# EAGLE design blimpy-2.1 (EAGLE 9.6.1)
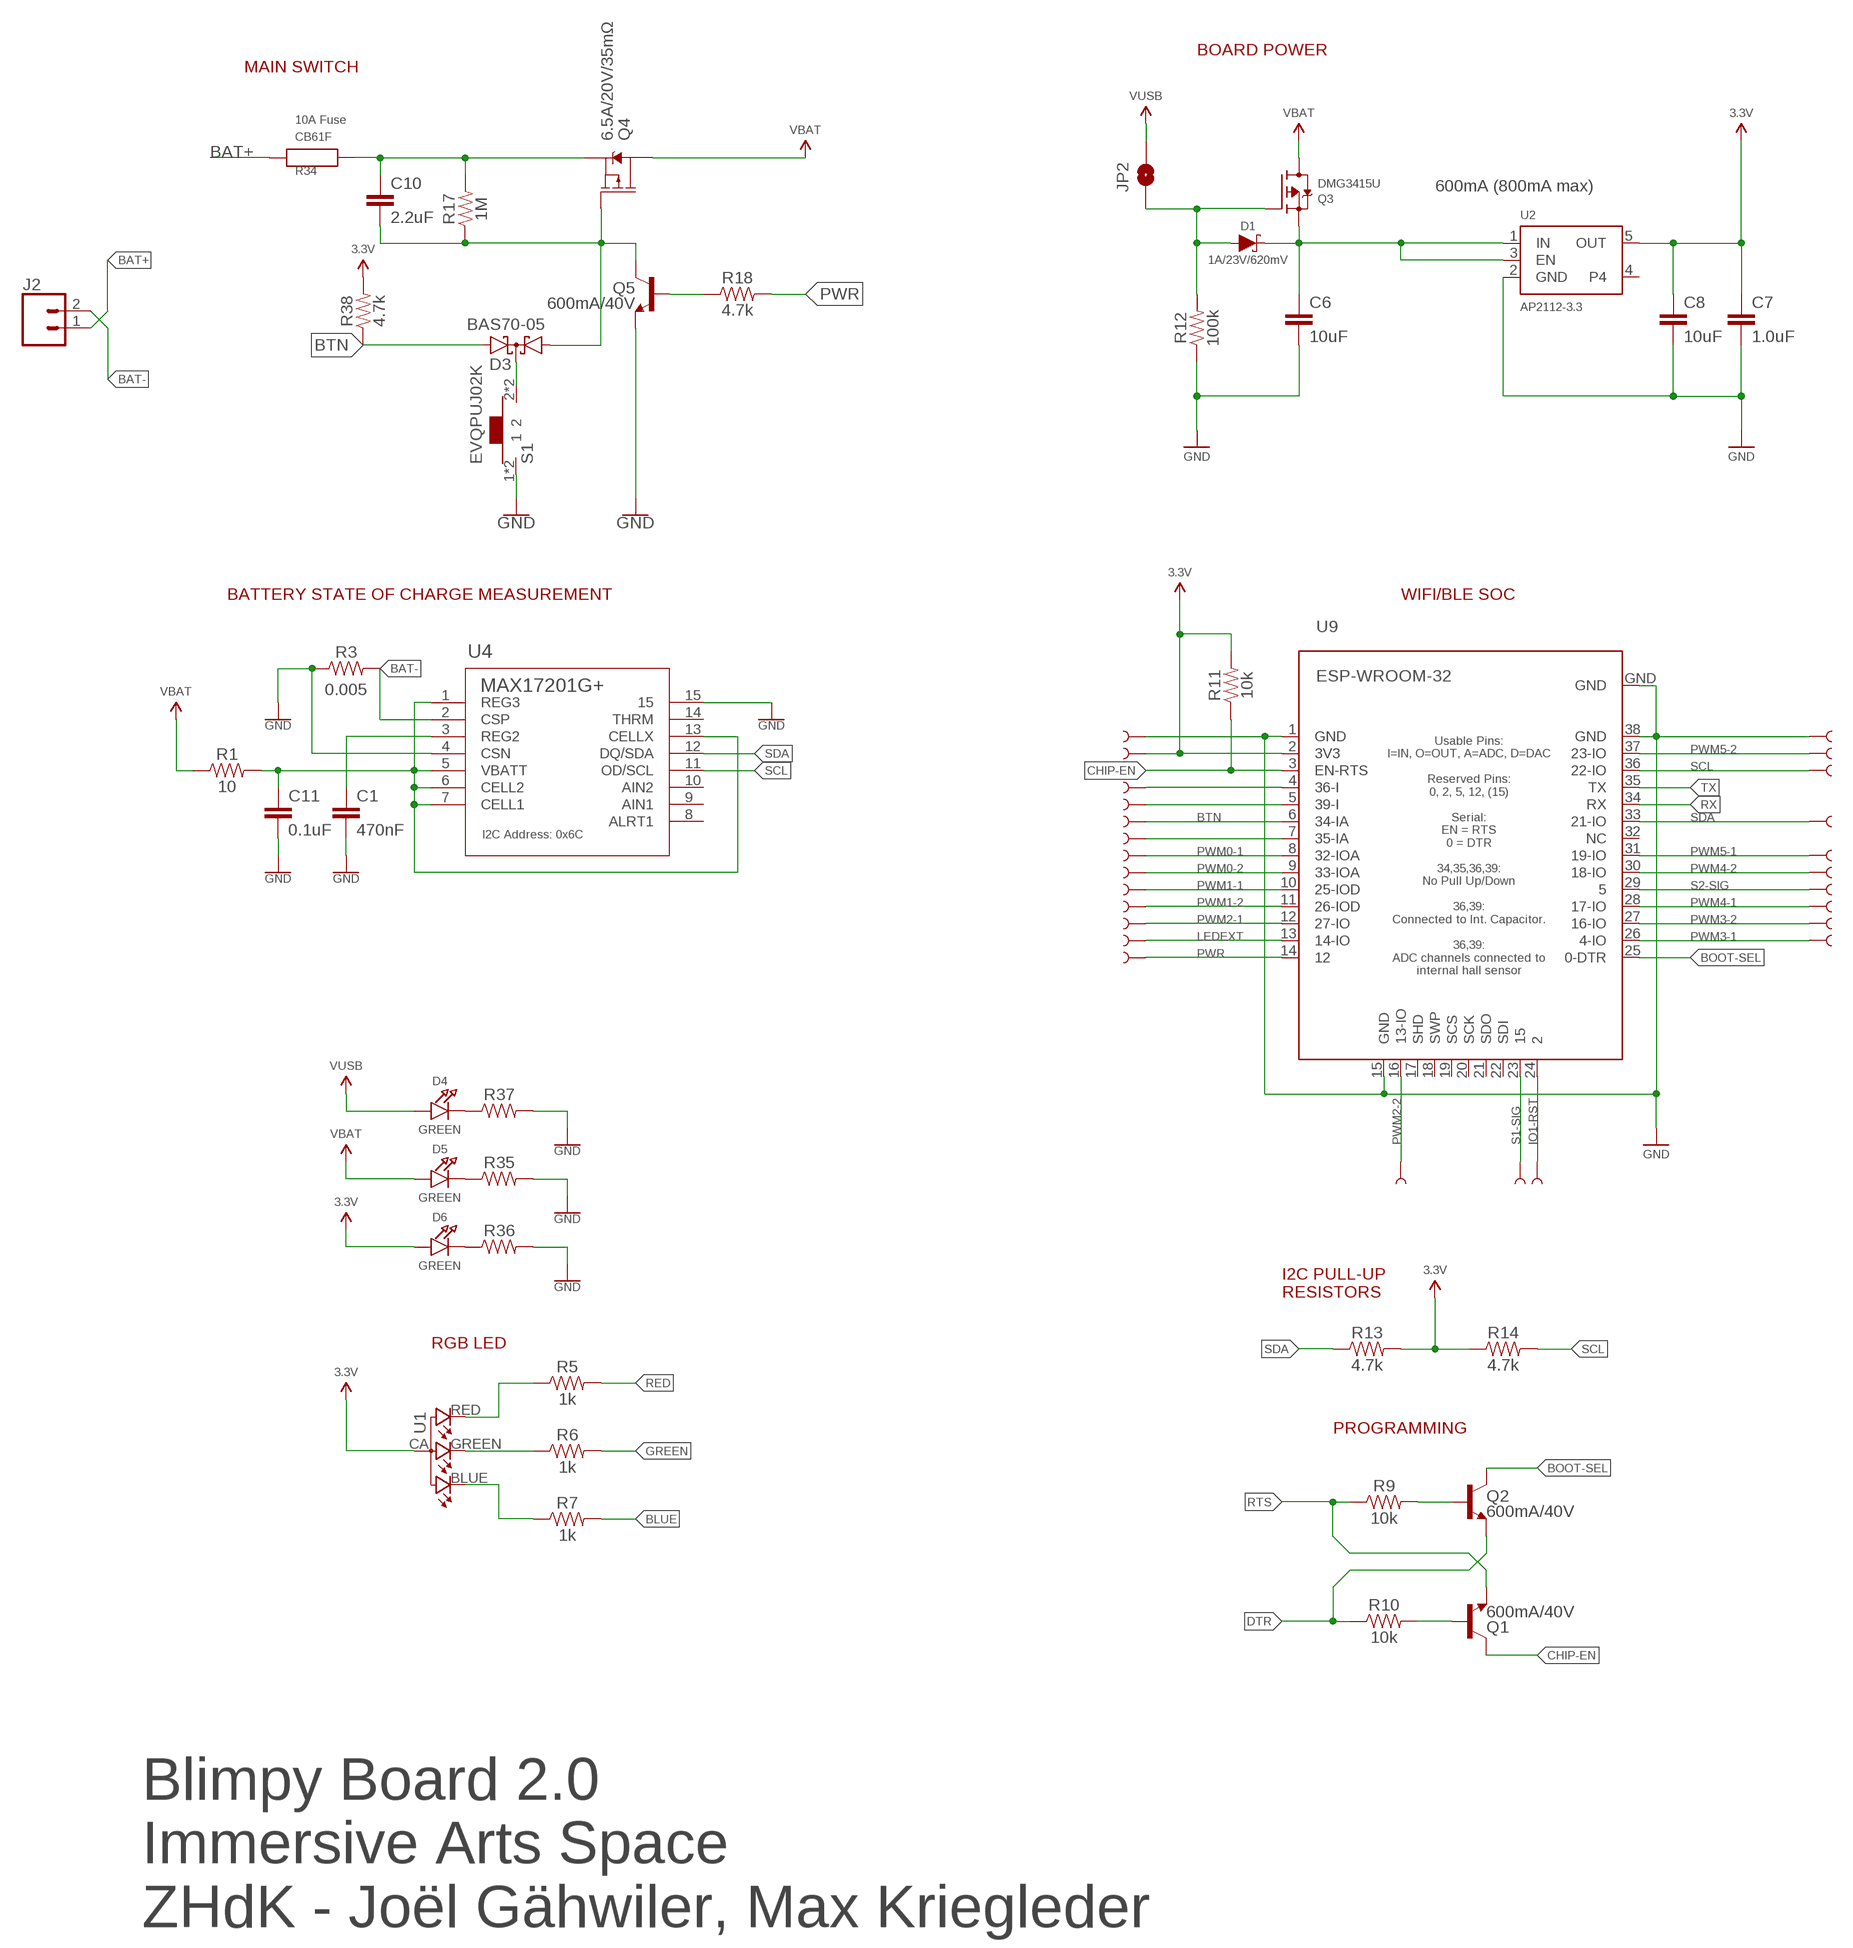
[diagram p0: schematic, sheet 1, part 1 of 2]
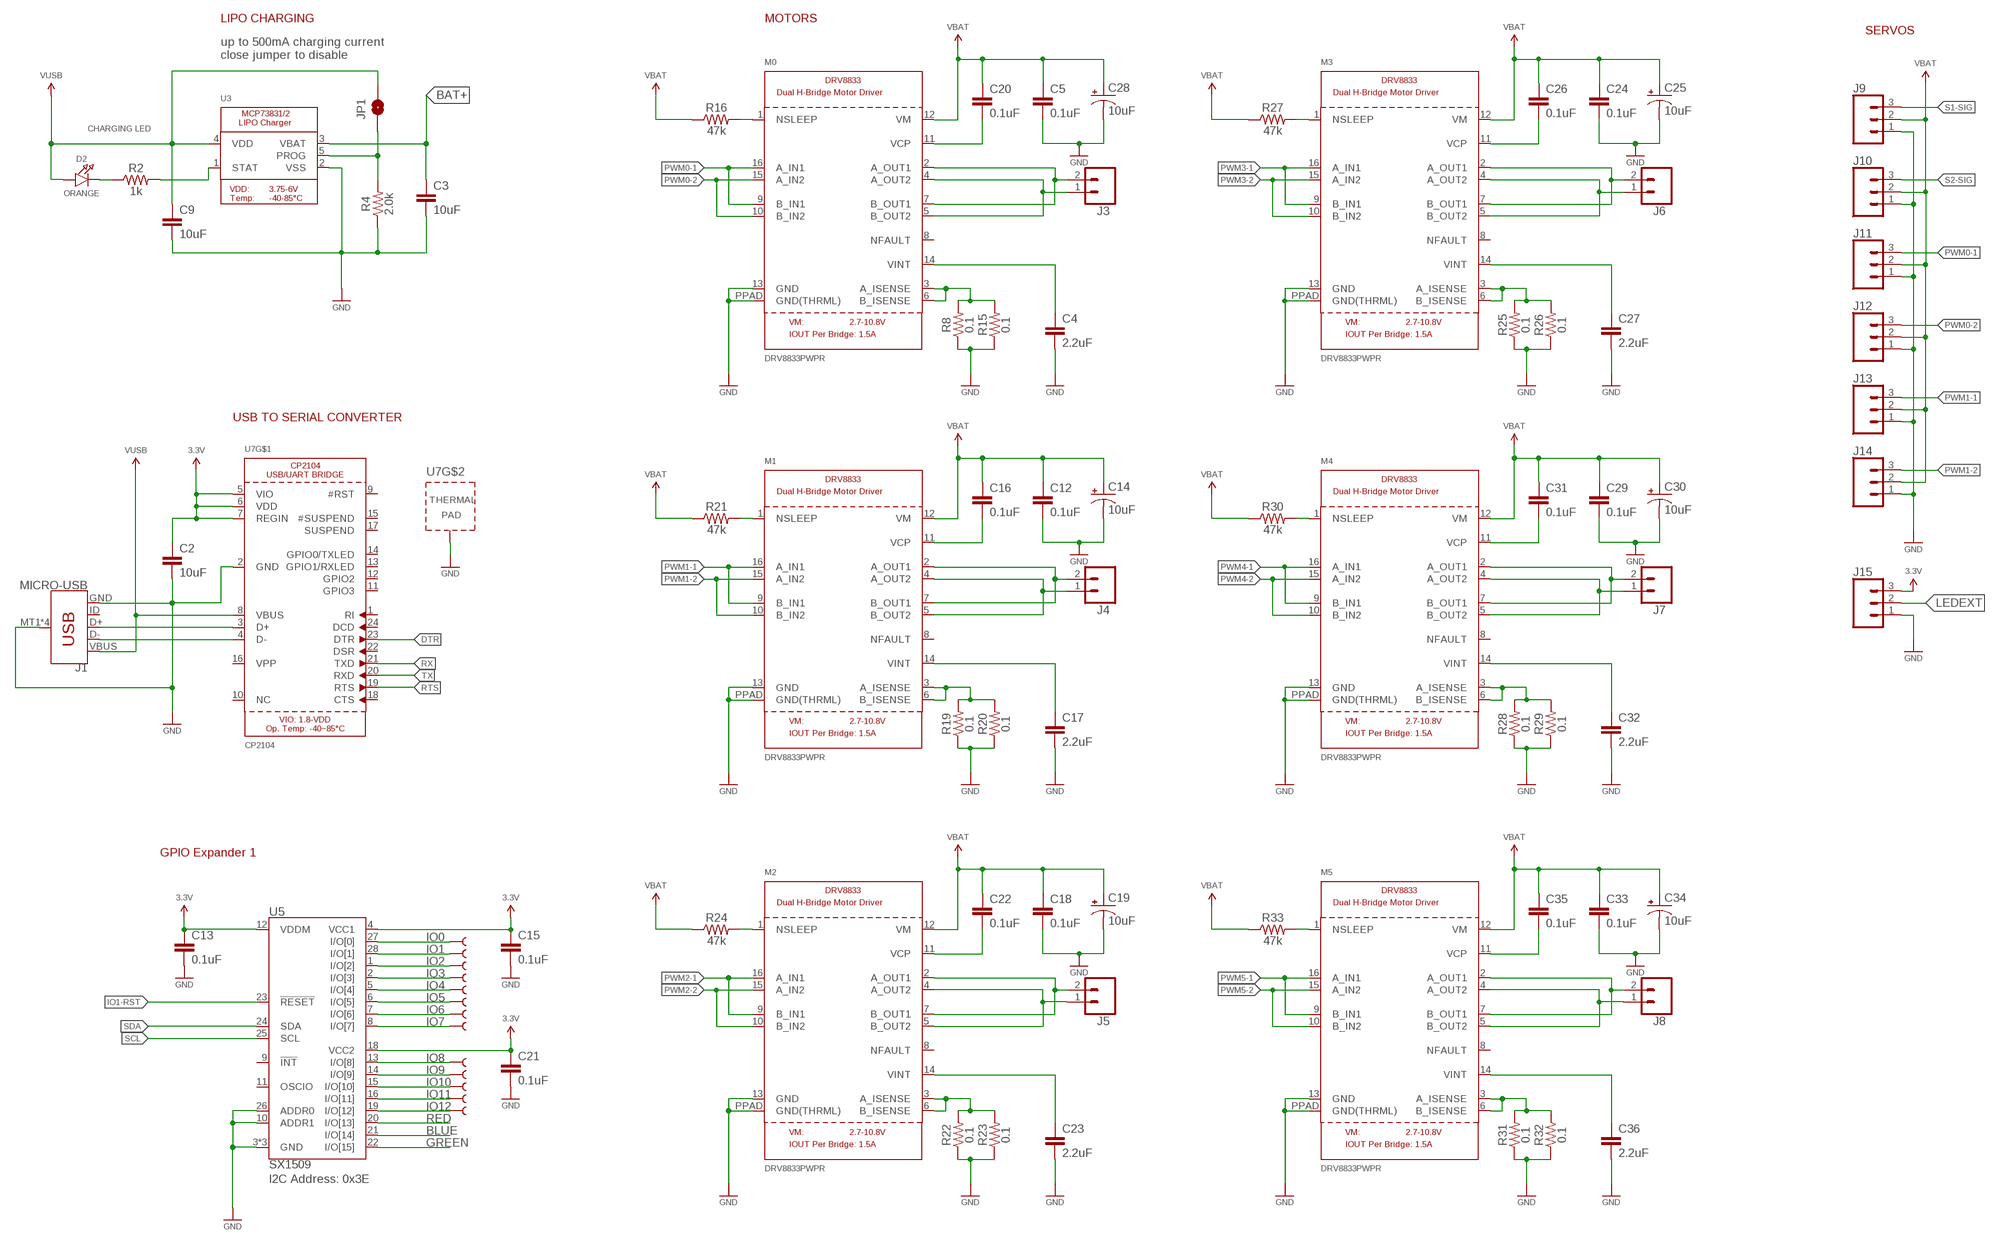
[diagram p1: schematic, sheet 1, part 2 of 2]

## Parts
C1  470nF  470NF-0608  [0603]
C2  10uF  10UF-0603-6.3V-20%  [0603]
C3  10uF  10UF-0603-6.3V-20%  [0603]
C4  2.2uF  2.2UF-0603-10V-20%  [0603]
C5  0.1uF  0.1UF-0603-25V-5%  [0603]
C6  10uF  10UF-0603-6.3V-20%  [0603]
C7  1.0uF  1.0UF-0603-16V-10%  [0603]
C8  10uF  10UF-0603-6.3V-20%  [0603]
C9  10uF  10UF-0603-6.3V-20%  [0603]
C10  2.2uF  2.2UF-0603-10V-20%  [0603]
C11  0.1uF  0.1UF-0603-25V-5%  [0603]
C12  0.1uF  0.1UF-0603-25V-5%  [0603]
C13  0.1uF  0.1UF-0603-25V-5%  [0603]
C14  10uF  10UF-POLAR-EIA3216-16V-10%(TANT)  [EIA3216]
C15  0.1uF  0.1UF-0603-25V-5%  [0603]
C16  0.1uF  0.1UF-0603-25V-5%  [0603]
C17  2.2uF  2.2UF-0603-10V-20%  [0603]
C18  0.1uF  0.1UF-0603-25V-5%  [0603]
C19  10uF  10UF-POLAR-EIA3216-16V-10%(TANT)  [EIA3216]
C20  0.1uF  0.1UF-0603-25V-5%  [0603]
C21  0.1uF  0.1UF-0603-25V-5%  [0603]
C22  0.1uF  0.1UF-0603-25V-5%  [0603]
C23  2.2uF  2.2UF-0603-10V-20%  [0603]
C24  0.1uF  0.1UF-0603-25V-5%  [0603]
C25  10uF  10UF-POLAR-EIA3216-16V-10%(TANT)  [EIA3216]
C26  0.1uF  0.1UF-0603-25V-5%  [0603]
C27  2.2uF  2.2UF-0603-10V-20%  [0603]
C28  10uF  10UF-POLAR-EIA3216-16V-10%(TANT)  [EIA3216]
C29  0.1uF  0.1UF-0603-25V-5%  [0603]
C30  10uF  10UF-POLAR-EIA3216-16V-10%(TANT)  [EIA3216]
C31  0.1uF  0.1UF-0603-25V-5%  [0603]
C32  2.2uF  2.2UF-0603-10V-20%  [0603]
C33  0.1uF  0.1UF-0603-25V-5%  [0603]
C34  10uF  10UF-POLAR-EIA3216-16V-10%(TANT)  [EIA3216]
C35  0.1uF  0.1UF-0603-25V-5%  [0603]
C36  2.2uF  2.2UF-0603-10V-20%  [0603]
D1  1A/23V/620mV  DIODE-SCHOTTKY-BAT20J  [SOD-323]
D2  ORANGE  LED0805_NOOUTLINE  [CHIPLED_0805_NOOUTLINE]
D3  BAS70-05  [SOT23]
D4  GREEN  LED0805_NOOUTLINE  [CHIPLED_0805_NOOUTLINE]
D5  GREEN  LED0805_NOOUTLINE  [CHIPLED_0805_NOOUTLINE]
D6  GREEN  LED0805_NOOUTLINE  [CHIPLED_0805_NOOUTLINE]
J1  MICRO-USB  USB_MICRO-B_SMT  [USB-MICROB]
J2  CONN_02PTH4  [1X02_XTRA_BIG]
J3  CONN_02-JST-2MM-SMT  [JST-2-SMD]
J4  CONN_02-JST-2MM-SMT  [JST-2-SMD]
J5  CONN_02-JST-2MM-SMT  [JST-2-SMD]
J6  CONN_02-JST-2MM-SMT  [JST-2-SMD]
J7  CONN_02-JST-2MM-SMT  [JST-2-SMD]
J8  CONN_02-JST-2MM-SMT  [JST-2-SMD]
J9  3-PIN SMD  CONN_03JST-SMD  [JST-3-SMD]
J10  3-PIN SMD  CONN_03JST-SMD  [JST-3-SMD]
J11  3-PIN SMD  CONN_03JST-SMD  [JST-3-SMD]
J12  3-PIN SMD  CONN_03JST-SMD  [JST-3-SMD]
J13  3-PIN SMD  CONN_03JST-SMD  [JST-3-SMD]
J14  3-PIN SMD  CONN_03JST-SMD  [JST-3-SMD]
J15  3-PIN SMD  CONN_03JST-SMD  [JST-3-SMD]
JP1  JUMPER-SMT_2_NO_SILK  [SMT-JUMPER_2_NO_SILK]
JP2  JUMPER-SMT_2_NO_SILK  [SMT-JUMPER_2_NO_SILK]
M0  DRV8833PWPR  DRV8833  [HTSSOP16]
M1  DRV8833PWPR  DRV8833  [HTSSOP16]
M2  DRV8833PWPR  DRV8833  [HTSSOP16]
M3  DRV8833PWPR  DRV8833  [HTSSOP16]
M4  DRV8833PWPR  DRV8833  [HTSSOP16]
M5  DRV8833PWPR  DRV8833  [HTSSOP16]
Q1  600mA/40V  TRANS_NPN-MMBT2222AL  [SOT23-3]
Q2  600mA/40V  TRANS_NPN-MMBT2222AL  [SOT23-3]
Q3  DMG3415U  MOSFET-P  [SOT23-R]
Q4  6.5A/20V/35mΩ  MOSFET_PCH-NDS8434  [SO08]
Q5  600mA/40V  TRANS_NPN-MMBT2222AL  [SOT23-3]
R1  10  10OHM-0603-1/10W-1%  [0603]
R2  1k  1KOHM-0603-1/10W-1%  [0603]
R3  0.005  RESISTOR1206  [1206]
R4  2.0k  2.0KOHM-0603-1/10W-5%  [0603]
R5  1k  1KOHM-0603-1/10W-1%  [0603]
R6  1k  1KOHM-0603-1/10W-1%  [0603]
R7  1k  1KOHM-0603-1/10W-1%  [0603]
R8  0.1  RESISTOR1206  [1206]
R9  10k  10KOHM-0603-1/10W-1%  [0603]
R10  10k  10KOHM-0603-1/10W-1%  [0603]
R11  10k  10KOHM-0603-1/10W-1%  [0603]
R12  100k  100KOHM-0603-1/10W-1%  [0603]
R13  4.7k  4.7KOHM-0603-1/10W-1%  [0603]
R14  4.7k  4.7KOHM-0603-1/10W-1%  [0603]
R15  0.1  RESISTOR1206  [1206]
R16  47k  47KOHM-0603-1/10W-1%  [0603]
R17  1M  1MOHM-0603-1/4W-5%  [0603]
R18  4.7k  4.7KOHM-0603-1/10W-1%  [0603]
R19  0.1  RESISTOR1206  [1206]
R20  0.1  RESISTOR1206  [1206]
R21  47k  47KOHM-0603-1/10W-1%  [0603]
R22  0.1  RESISTOR1206  [1206]
R23  0.1  RESISTOR1206  [1206]
R24  47k  47KOHM-0603-1/10W-1%  [0603]
R25  0.1  RESISTOR1206  [1206]
R26  0.1  RESISTOR1206  [1206]
R27  47k  47KOHM-0603-1/10W-1%  [0603]
R28  0.1  RESISTOR1206  [1206]
R29  0.1  RESISTOR1206  [1206]
R30  47k  47KOHM-0603-1/10W-1%  [0603]
R31  0.1  RESISTOR1206  [1206]
R32  0.1  RESISTOR1206  [1206]
R33  47k  47KOHM-0603-1/10W-1%  [0603]
R34  CB61F  [CB61F]
R35  RESISTOR0603  [0603]
R36  RESISTOR0603  [0603]
R37  RESISTOR0603  [0603]
R38  4.7k  1MOHM-0603-1/4W-5%  [0603]
S1  EVQPUJ02K  [EVQPUJ02K]
TP1  TEST-POINT3  [PAD.03X.03]
TP2  TEST-POINT3  [PAD.03X.03]
TP3  TEST-POINT3  [PAD.03X.03]
TP4  TEST-POINT3  [PAD.03X.03]
TP5  TEST-POINT3  [PAD.03X.03]
TP6  TEST-POINT3  [PAD.03X.03]
TP7  TEST-POINT3  [PAD.03X.03]
TP8  TEST-POINT3  [PAD.03X.03]
TP9  TEST-POINT3  [PAD.03X.03]
TP10  TEST-POINT3  [PAD.03X.03]
TP11  TEST-POINT3  [PAD.03X.03]
TP12  TEST-POINT3  [PAD.03X.03]
TP13  TEST-POINT3  [PAD.03X.03]
TP14  TEST-POINT3  [PAD.03X.03]
TP15  TEST-POINT3  [PAD.03X.03]
TP16  TEST-POINT3  [PAD.03X.03]
TP17  TEST-POINT3  [PAD.03X.03]
TP18  TEST-POINT3  [PAD.03X.03]
TP19  TEST-POINT3  [PAD.03X.03]
TP20  TEST-POINT3  [PAD.03X.03]
TP21  TEST-POINT3  [PAD.03X.03]
TP22  TEST-POINT3  [PAD.03X.03]
TP23  TEST-POINT3  [PAD.03X.03]
TP24  TEST-POINT3  [PAD.03X.03]
TP25  TEST-POINT3  [PAD.03X.03]
TP26  TEST-POINT3  [PAD.03X.03]
TP27  TEST-POINT3  [PAD.03X.03]
TP28  TEST-POINT3  [PAD.03X.03]
TP29  TEST-POINT3  [PAD.03X.03]
TP30  TEST-POINT3  [PAD.03X.03]
TP31  TEST-POINT3  [PAD.03X.03]
TP32  TEST-POINT3  [PAD.03X.03]
TP33  TEST-POINT3  [PAD.03X.03]
TP34  TEST-POINT3  [PAD.03X.03]
TP35  TEST-POINT3  [PAD.03X.03]
TP36  TEST-POINT3  [PAD.03X.03]
TP37  TEST-POINT3  [PAD.03X.03]
TP38  TEST-POINT3  [PAD.03X.03]
TP39  TEST-POINT3  [PAD.03X.03]
U1  PARTICLE_RGB-LED-CLMVB-FKARGB  [PARTICLE_PLCC4-2MM-RGB]
U2  AP2112-3.3  VREG_SOT23-5  [SOT23-5]
U3  MICROBUILDER_MCP73831/2  [MICROBUILDER_SOT23-5]
U4  MAX17201G+  [21-0137I_T1433-1_MXM]
U5  SX1509  [QFN-28]
U7  CP2104  [QFN24_4MM_SMSC]
U9  ESP-WROOM-32  [ESP-WROOM-32]

## Nets
3.3V: C2.1 C7.1 C8.1 C13.1 C15.1 C21.1 D6.A J15.3 R11.2 R13.2 R14.1 R38.2 TP11.P$1 U1.CA U2.5(OUT) U5.4(VCC1) U5.12(VDDM) U5.18(VCC2) U7.5(VIO) U7.6(VDD) U7.7(REGIN) U9.2(3V3)
BAT+: C3.1 J2.1 R34.1 U3.3(VBAT)
BAT-: J2.2 R3.2 U4.2(CSP)
BLUE: R7.2 U5.21(I/O[14])
BOOT-SEL: Q2.3(C) U9.25(0-DTR)
BTN: D3.2(A2) R38.1 TP8.P$1 U9.6(34-IA)
CHIP-EN: Q1.3(C) R11.1 U9.3(EN-RTS)
DTR: Q2.2(E) R10.1 U7.23(DTR)
GND: C1.2 C2.2 C3.2 C4.2 C5.2 C6.2 C7.2 C8.2 C9.2 C11.2 C12.2 C13.2 C14.- C15.2 C17.2 C18.2 C19.- C21.2 C23.2 C24.2 C25.- C27.2 C28.- C29.2 C30.- C32.2 C33.2 C34.- C36.2 J1.GND J1.MT1(SHIELD) J1.MT2(SHIELD) J1.P$1(SHIELD) J1.P$2(SHIELD) J9.1 J10.1 J11.1 J12.1 J13.1 J14.1 J15.1 M0.13(GND) M0.PPAD(GND(THRML)) M1.13(GND) M1.PPAD(GND(THRML)) M2.13(GND) M2.PPAD(GND(THRML)) M3.13(GND) M3.PPAD(GND(THRML)) M4.13(GND) M4.PPAD(GND(THRML)) M5.13(GND) M5.PPAD(GND(THRML)) Q5.2(E) R3.1 R4.1 R8.1 R12.1 R15.1 R19.1 R20.1 R22.1 R23.1 R25.1 R26.1 R28.1 R29.1 R31.1 R32.1 R35.2 R36.2 R37.2 S1.1 S1.3 TP12.P$1 TP13.P$1 U2.2(GND) U3.2(VSS) U4.4(CSN) U4.15 U5.3(GND) U5.10(ADDR1) U5.17(GND) U5.26(ADDR0) U5.29(GND) U7.2(GND) U7.THERM(TP) U9.1(GND) U9.15(GND) U9.38(GND) U9.GND
GREEN: R6.2 U5.22(I/O[15])
IO0: TP27.P$1 U5.27(I/O[0])
IO1: TP28.P$1 U5.28(I/O[1])
IO1-RST: TP26.P$1 U5.23(!RESET) U9.24
IO2: TP29.P$1 U5.1(I/O[2])
IO3: TP30.P$1 U5.2(I/O[3])
IO4: TP31.P$1 U5.5(I/O[4])
IO5: TP32.P$1 U5.6(I/O[5])
IO6: TP33.P$1 U5.7(I/O[6])
IO7: TP34.P$1 U5.8(I/O[7])
IO8: TP35.P$1 U5.13(I/O[8])
IO9: TP36.P$1 U5.14(I/O[9])
IO10: TP37.P$1 U5.15(I/O[10])
IO11: TP38.P$1 U5.16(I/O[11])
IO12: TP39.P$1 U5.19(I/O[12])
LEDEXT: J15.2 TP5.P$1 U9.13(14-IO)
N$1: D2.C R2.1
N$2: J1.D+ U7.3(D+)
N$3: R2.2 U3.1(STAT)
N$4: JP1.1 R4.2 U3.5(PROG)
N$5: M0.1(NSLEEP) R16.2
N$6: J1.D- U7.4(D-)
N$7: C6.1 D1.C Q3.2(S) U2.1(IN) U2.3(EN)
N$8: C1.1 U4.3(REG2)
N$9: R5.1 U1.RED
N$10: R7.1 U1.BLUE
N$11: R6.1 U1.GREEN
N$12: Q1.1(B) R10.2
N$13: Q2.1(B) R9.2
N$14: M0.3(A_ISENSE) M0.6(B_ISENSE) R8.2 R15.2
N$15: C11.1 R1.2 U4.1(REG3) U4.5(VBATT) U4.6(CELL2) U4.7(CELL1) U4.13(CELLX)
N$16: C10.2 D3.1(A1) Q4.4(G) Q5.3(C) R17.1
N$17: D4.C R37.1
N$18: C10.1 Q4.1(S) Q4.2(S) Q4.3(S) R17.2 R34.2
N$19: TP9.P$1 U9.5(39-I)
N$20: D1.A JP2.1 Q3.1(G) R12.2
N$21: TP7.P$1 U9.7(35-IA)
N$22: D3.3(C) S1.2 S1.4
N$23: Q5.1(B) R18.1
N$24: J4.1 M1.4(A_OUT2) M1.5(B_OUT2)
N$25: J4.2 M1.2(A_OUT1) M1.7(B_OUT1)
N$26: C17.1 M1.14(VINT)
N$27: C16.2 M1.11(VCP)
N$28: M1.3(A_ISENSE) M1.6(B_ISENSE) R19.2 R20.2
N$29: M1.1(NSLEEP) R21.2
N$30: J6.1 M3.4(A_OUT2) M3.5(B_OUT2)
N$31: J5.1 M2.4(A_OUT2) M2.5(B_OUT2)
N$32: C23.1 M2.14(VINT)
N$33: C22.2 M2.11(VCP)
N$34: M2.3(A_ISENSE) M2.6(B_ISENSE) R22.2 R23.2
N$35: M2.1(NSLEEP) R24.2
N$36: J6.2 M3.2(A_OUT1) M3.7(B_OUT1)
N$37: J3.2 M0.2(A_OUT1) M0.7(B_OUT1)
N$38: J7.1 M4.4(A_OUT2) M4.5(B_OUT2)
N$39: C27.1 M3.14(VINT)
N$40: C26.2 M3.11(VCP)
N$41: M3.3(A_ISENSE) M3.6(B_ISENSE) R25.2 R26.2
N$42: M3.1(NSLEEP) R27.2
N$43: J8.2 M5.2(A_OUT1) M5.7(B_OUT1)
N$44: J7.2 M4.2(A_OUT1) M4.7(B_OUT1)
N$45: C32.1 M4.14(VINT)
N$46: C31.2 M4.11(VCP)
N$47: M4.3(A_ISENSE) M4.6(B_ISENSE) R28.2 R29.2
N$48: J5.2 M2.2(A_OUT1) M2.7(B_OUT1)
N$49: M4.1(NSLEEP) R30.2
N$50: J8.1 M5.4(A_OUT2) M5.5(B_OUT2)
N$51: D6.C R36.1
N$52: C36.1 M5.14(VINT)
N$53: C35.2 M5.11(VCP)
N$54: M5.3(A_ISENSE) M5.6(B_ISENSE) R31.2 R32.2
N$55: M5.1(NSLEEP) R33.2
N$56: D5.C R35.1
N$57: TP10.P$1 U9.4(36-I)
N$58: J3.1 M0.4(A_OUT2) M0.5(B_OUT2)
N$61: C4.1 M0.14(VINT)
N$64: C20.2 M0.11(VCP)
PWM0-1: J11.3 M0.9(B_IN1) M0.16(A_IN1) TP1.P$1 U9.8(32-IOA)
PWM0-2: J12.3 M0.10(B_IN2) M0.15(A_IN2) TP2.P$1 U9.9(33-IOA)
PWM1-1: J13.3 M1.9(B_IN1) M1.16(A_IN1) TP3.P$1 U9.10(25-IOD)
PWM1-2: J14.3 M1.10(B_IN2) M1.15(A_IN2) TP6.P$1 U9.11(26-IOD)
PWM2-1: M2.9(B_IN1) M2.16(A_IN1) TP17.P$1 U9.12(27-IO)
PWM2-2: M2.10(B_IN2) M2.15(A_IN2) TP23.P$1 U9.16(13-IO)
PWM3-1: M3.9(B_IN1) M3.16(A_IN1) TP16.P$1 U9.26(4-IO)
PWM3-2: M3.10(B_IN2) M3.15(A_IN2) TP15.P$1 U9.27(16-IO)
PWM4-1: M4.9(B_IN1) M4.16(A_IN1) TP22.P$1 U9.28(17-IO)
PWM4-2: M4.10(B_IN2) M4.15(A_IN2) TP21.P$1 U9.30(18-IO)
PWM5-1: M5.9(B_IN1) M5.16(A_IN1) TP20.P$1 U9.31(19-IO)
PWM5-2: M5.10(B_IN2) M5.15(A_IN2) TP14.P$1 U9.37(23-IO)
PWR: R18.2 TP4.P$1 U9.14
RED: R5.2 U5.20(I/O[13])
RTS: Q1.2(E) R9.1 U7.19(RTS)
RX: U7.21(TXD) U9.34(RX)
S1-SIG: J9.3 TP24.P$1 U9.23
S2-SIG: J10.3 TP25.P$1 U9.29
SCL: R14.2 TP18.P$1 U4.11(OD/SCL) U5.25(SCL) U9.36(22-IO)
SDA: R13.1 TP19.P$1 U4.12(DQ/SDA) U5.24(SDA) U9.33(21-IO)
TX: U7.20(RXD) U9.35(TX)
V_BATT: C5.1 C12.1 C14.+ C16.1 C18.1 C19.+ C20.1 C22.1 C24.1 C25.+ C26.1 C28.+ C29.1 C30.+ C31.1 C33.1 C34.+ C35.1 D5.A J9.2 J10.2 J11.2 J12.2 J13.2 J14.2 M0.12(VM) M1.12(VM) M2.12(VM) M3.12(VM) M4.12(VM) M5.12(VM) Q3.3(D) Q4.5(D) Q4.6(D) Q4.7(D) Q4.8(D) R1.1 R16.1 R21.1 R24.1 R27.1 R30.1 R33.1 ; supply symbol labelled VBAT
V_USB: C9.1 D2.A D4.A J1.VBUS JP1.2 JP2.2 U3.4(VDD) U7.8(VBUS) ; supply symbol labelled VUSB
Unconnected: J1.ID M0.8(NFAULT) M1.8(NFAULT) M2.8(NFAULT) M3.8(NFAULT) M4.8(NFAULT) M5.8(NFAULT) U2.4 U4.8(ALRT1) U4.9(AIN1) U4.10(AIN2) U4.14(THRM) U5.9(!INT) U5.11(OSCIO) U7.1(RI) U7.9(#RST) U7.10(NC) U7.11(GPIO3) U7.12(GPIO2) U7.13(GPIO1/RXLED) U7.14(GPIO0/TXLED) U7.15(#SUSPEND) U7.16(VPP) U7.17(SUSPEND) U7.18(CTS) U7.22(DSR) U7.24(DCD) U9.17(SHD) U9.18(SWP) U9.19(SCS) U9.20(SCK) U9.21(SDO) U9.22(SDI) U9.32(NC)

## Notes on the sheet
- LIPO CHARGING | MOTORS
- BOARD POWER | SERVOS
- MAIN SWITCH
- up to 500mA charging current
  close jumper to disable
- 10A Fuse
- 600mA (800mA max) | CHARGING LED
- BATTERY STATE OF CHARGE MEASUREMENT | WIFI/BLE SOC | USB TO SERIAL CONVERTER
- I2C Address: 0x6C
- GPIO Expander 1
- I2C PULL-UP
  RESISTORS
- RGB LED
- PROGRAMMING
- I2C Address: 0x3E
- Blimpy Board 2.0
  Immersive Arts Space
  ZHdK - Joël Gähwiler, Max Kriegleder

## Library data of the parts
C1 = SparkFun-Capacitors:470NF: 0.47uF/470nF ceramic capacitors A capacitor is a passive two-terminal electrical component used to store electrical energy temporarily in an electric field.
C2 C3 C6 C8 C9 = SparkFun-Capacitors:10UF: 10.0µF ceramic capacitors A capacitor is a passive two-terminal electrical component used to store electrical energy temporarily in an electric field.; PROD_ID: CAP-11015
C4 C10 C17 C23 C27 C32 C36 = SparkFun-Capacitors:2.2UF: 2.2µF ceramic capacitors A capacitor is a passive two-terminal electrical component used to store electrical energy temporarily in an electric field.; PROD_ID: CAP-07888
C5 C11-C13 C15 C16 C18 C20-C22 C24 C26 C29 C31 C33 C35 = SparkFun-Capacitors:0.1UF: 0.1µF ceramic capacitors A capacitor is a passive two-terminal electrical component used to store electrical energy temporarily in an electric field.; PROD_ID: CAP-08604
C7 = SparkFun-Capacitors:1.0UF: 1µF ceramic capacitors A capacitor is a passive two-terminal electrical component used to store electrical energy temporarily in an electric field.; PROD_ID: CAP-00868
C14 C19 C25 C28 C30 C34 = SparkFun-Capacitors:10UF-POLAR: 10.0µF polarized capacitors A capacitor is a passive two-terminal electrical component used to store electrical energy temporarily in an electric field.; PROD_ID: CAP-00811
D1 = SparkFun-DiscreteSemi:DIODE-SCHOTTKY: Schottky diode A Schottky diode is a semiconductor diode which has a low forward voltage drop and a very fast switching action.; PROD_ID: DIO-11623
D2 D4-D6 = microbuilder:LED: LED 0603 - 0603 Surface Mount Package 2mA: Green LED - Low Power (3.9mcd, 2ma, 1.7Vf) - Digikey: 475-2709-2-ND Orange LED - Low Power (9.8mcd, 2ma, 1.8Vf) - Digikey: 475-1194-2-ND Red LED - Low Power (5mcd, 2ma, 1.8Vf) - Digikey: 475-1195-2-ND Yellow LED - Low Power (7mcd, 2ma, 1.8Vf) - Digikey: 475-1196-2-ND 5mA: Blue LED - Low Power (17mcd, 5ma, 2.9Vf) - Digikey: LNJ937W8CRACT-ND 0805 - 0805 Surface Mount Package 2mA: Red LED (8.8mcd, 2mA, 1.8Vf, Clear) - Low Power [Digikey: 475-2510-1-ND] Green LED (5mcd, 2mA, 1.8Vf, Clear) - Low Power [Digikey: 475-2730-1-ND] Yellow LED (11.3mcd, 2mA, 1.8Vf, Clear) - Low Power [Digikey: 475-2555-1-ND] 20mA: Red LED (104mcd, 20mA, Diffused) - LS R976 [Digikey: 475-1278-6-ND] Red LED (12mcd, 20mA, 2.0Vf, Clear) - APT2012EC [Digikey: 754-1128-1-ND] Green LED (15mcd, 20mA, 2.2Vf, Clear) - APT2012GC [Digikey: 754-1131-1-ND] Orange LED (160mcd, 20mA, 2.1Vf, Clear) - APT2012SECK [Digikey: 754-1130-1-ND] 1206 - 1206 Surface Mount Package Green LED (26mcd, 20mA, Diffused) - LG N971 [Digikey: 475-1407-6-ND] Red LED (15mcd, 20mA, Diffused) - LH N974 [Digikey: 475-1416-6-ND] Cree - Cree High-Power Surface Mount LEDs XPEBWT-L1-0000-00D50 - White 111lm 350mA 2.9Vf 6200K 110° XTEAWT-00-0000-00000LEE3 - White 114lm 350mA 2.85Vf 5000K 115° Everlight - Everlight 45-21 Series Surface Mount LEDs 45-21/QK2C-B2832AC2CB2/2T - Warm White 2000mcd 20mA 3.25Vf 3050K 120° 45-21/LK2C-B38452C4CB2/2T - Nuetral White 2000mcd 20mA 3.25Vf 4150K 120° 45-21/LK2C-B50634C6CB2/2T - Cold White 2200mcd 20mA 3.25Vf 5650K 120° PLCC2 Reverse Mount LS T77K-J1L2-1-0-2-R18-Z - Red 11.25mcd 2mA 1.8Vf 630nm 120° LO T77K-L1M2-24-Z - Orange 19.6mcd 2mA 1.8Vf 606nm 120° LY T77K-K2M1-26-Z - Yellow 15.7mcd 2mA 1.8Vf 587nm 120°
D3 = diode:BAS70-05: Silicon Schottky Diodes General-purpose diode for high-speed switching
J1 = SparkFun-Connectors:USB_MICRO-B: USB Type Micro-B Connector Male/female and PTH/SMT variants SparkFun Products: SparkFun microB USB Breakout <https://www.sparkfun.com/products/12035> SparkFun USB microB Plug Breakout <https://www.sparkfun.com/products/10031> SparkFun ESP8266 Thing <https://www.sparkfun.com/products/13231>; PROD_ID: CONN-09505; SF_ID: PRT-08533
J2 = SparkFun-Connectors:CONN_02: Multi connection point. Often used as Generic Header-pin footprint for 0.1 inch spaced/style header connections On any of the 0.1 inch spaced packages, you can populate with these: Break Away Headers - Straight <https://www.sparkfun.com/products/116> (PRT-00116) Break Away Male Headers - Right Angle <https://www.sparkfun.com/products/553> (PRT-00553) Female Headers <https://www.sparkfun.com/products/115> (PRT-00115) Break Away Headers - Machine Pin <https://www.sparkfun.com/products/117> (PRT-00117) Break Away Female Headers - Swiss Machine Pin <https://www.sparkfun.com/products/743> (PRT-00743) For SCREWTERMINALS and SPRING TERMINALS visit here: Screw Terimnals on SparkFun.com <https://www.sparkfun.com/search/results?term=Screw+Terminals> (5mm/3.5mm/2.54mm spacing) This device is also useful as a general connection point to wire up your design to another part of your project. Our various solder wires solder well into these plated through hole pads. Hook-Up Wire - Assortment (Stranded, 22 AWG) <https://www.sparkfun.com/products/11375> (PRT-11375) Hook-Up Wire - Assortment (Solid Core, 22 AWG) <https://www.sparkfun.com/products/11367> (PRT-11367) View the entire wire category on our website here <https://www.sparkfun.com/categories/141> Special notes: Molex polarized connector foot print use with: PRT-08233 with associated crimp pins and housings. 2.54_SCREWTERM for use with PRT-10571. 3.5mm Screw Terminal footprints for PRT-08084 5mm Screw Terminal footprints for use with PRT-08432
J3-J8 = SparkFun-Connectors:CONN_02: Multi connection point. Often used as Generic Header-pin footprint for 0.1 inch spaced/style header connections On any of the 0.1 inch spaced packages, you can populate with these: Break Away Headers - Straight <https://www.sparkfun.com/products/116> (PRT-00116) Break Away Male Headers - Right Angle <https://www.sparkfun.com/products/553> (PRT-00553) Female Headers <https://www.sparkfun.com/products/115> (PRT-00115) Break Away Headers - Machine Pin <https://www.sparkfun.com/products/117> (PRT-00117) Break Away Female Headers - Swiss Machine Pin <https://www.sparkfun.com/products/743> (PRT-00743) For SCREWTERMINALS and SPRING TERMINALS visit here: Screw Terimnals on SparkFun.com <https://www.sparkfun.com/search/results?term=Screw+Terminals> (5mm/3.5mm/2.54mm spacing) This device is also useful as a general connection point to wire up your design to another part of your project. Our various solder wires solder well into these plated through hole pads. Hook-Up Wire - Assortment (Stranded, 22 AWG) <https://www.sparkfun.com/products/11375> (PRT-11375) Hook-Up Wire - Assortment (Solid Core, 22 AWG) <https://www.sparkfun.com/products/11367> (PRT-11367) View the entire wire category on our website here <https://www.sparkfun.com/categories/141> Special notes: Molex polarized connector foot print use with: PRT-08233 with associated crimp pins and housings. 2.54_SCREWTERM for use with PRT-10571. 3.5mm Screw Terminal footprints for PRT-08084 5mm Screw Terminal footprints for use with PRT-08432; PROD_ID: CONN-11443
J9-J15 = SparkFun-Connectors:CONN_03: Multi connection point. Often used as Generic Header-pin footprint for 0.1 inch spaced/style header connections On any of the 0.1 inch spaced packages, you can populate with these: Break Away Headers - Straight <https://www.sparkfun.com/products/116> (PRT-00116) Break Away Male Headers - Right Angle <https://www.sparkfun.com/products/553> (PRT-00553) Female Headers <https://www.sparkfun.com/products/115> (PRT-00115) Break Away Headers - Machine Pin <https://www.sparkfun.com/products/117> (PRT-00117) Break Away Female Headers - Swiss Machine Pin <https://www.sparkfun.com/products/743> (PRT-00743) Stackable Header - 3 Pin (Female, 0.1") <https://www.sparkfun.com/products/13875> (PRT-13875) For SCREWTERMINALS and SPRING TERMINALS visit here: Screw Terimnals on SparkFun.com <https://www.sparkfun.com/search/results?term=Screw+Terminals> (5mm/3.5mm/2.54mm spacing) This device is also useful as a general connection point to wire up your design to another part of your project. Our various solder wires solder well into these plated through hole pads. Hook-Up Wire - Assortment (Stranded, 22 AWG) <https://www.sparkfun.com/products/11375> (PRT-11375) Hook-Up Wire - Assortment (Solid Core, 22 AWG) <https://www.sparkfun.com/products/11367> (PRT-11367) View the entire wire category on our website here <https://www.sparkfun.com/categories/141> Special notes: Molex polarized connector foot print use with SKU : PRT-08232 with associated crimp pins and housings.; PROD_ID: CONN-12591
JP1 JP2 = SparkFun-Jumpers:JUMPER-SMT_2_NO: Normally open jumper This jumper has two pads in close proximity to each other. Apply solder to close the connection. Round pads are easier to solder for beginners, but are a lot larger. SparkFun Product that uses the round pads: SparkFun EL Sequencer <https://www.sparkfun.com/products/12781>
M0 M1-M5 = microbuilder:DRV8833: DRV8833 Dual H-Bridge Motor Driver -- HTSSOP Package
Q1 Q2 Q5 = SparkFun-DiscreteSemi:TRANS_NPN: NPN transistor Current controlled devices typically used to amplify current or used as a switch. BC547 - COM-08928 <http://www.sparkfun.com/products/8928> (TO-92 45V 100mA) (1.Collector 2.Base 3.Emitter) 2N3904 - COM-00521 <http://www.sparkfun.com/products/521> (TO-92 40V 200mA) (1.Emitter 2.Base 3.Collector) P2N2222A - COM-12852 <http://www.sparkfun.com/products/12852> (TO-92 40V 600mA) (1.Collector 2.Base 3.Emitter); PROD_ID: TRANS-08049
Q3 = microbuilder:MOSFET-P: P-Channel Mosfet LEGEND VDS: Voltage Drain-Source ID: Drain Current RDS(ON): Drain-Source On-State Resistance VGS(TH): Gate-Source Threshold Voltage CISS: Drain-Source Input Capacitance SOT-23 Name VDS ID RDS(ON) VGS(TH) CISS Order Number IRLML5103 30V 760mA 600 mOhm -- 75pF @ 25V Digikey: IRLML5103PBFCT-ND IRLML6401 12V 4.3A 50 mOhm 950mV @ 250µA 830pF @ 10V Digikey: IRLML6401PBFTR-ND NTR0202PL 20V 400mA 800 mOhm 2.3V @ 250uA 70pF @ 5V Digikey: NTR0202PLT1GOSTR-ND NTR4101PT1G 20V 1.8A 85 mOhm 1.2V @ 250uA 675pF @ 10V Digikey: NTR4101PT1GOSCT-ND DMP2004K 20V 600mA 900 mOhm 1V @ 250uA 175pF @ 16V Digikey: DMP2004KDICT-ND PMV65XP 20V 3.9A 76 mOhm 950mV @ 1mA 725pF @ 20V Digikey: 568-2358-2-ND TO-252 Name VDS ID RDS(ON) VGS(TH) CISS Order Number AOD417 30V 25A 34 mOhm 3V @ 250µA 920pF @ 15V Digikey: 785-1106-2-ND PowerPak Name VDS ID RDS(ON) VGS(TH) CISS Order Number AON7401 30V 12A 14 mOhm 3V @ 250µA 2600pF @ 15V Digikey: 785-1302-1-ND
Q4 = SparkFun-DiscreteSemi:MOSFET_PCH: P-channel MOSFETs Voltage controlled devices that allow control of high current outputs. SparkFun Products: SparkFun ESP32 Thing <https://www.sparkfun.com/products/13907> SparkFun ESP8266 Thing <https://www.sparkfun.com/products/13231>; PROD_ID: TRANS-08355
R1 = SparkFun-Resistors:10OHM: 10Ω resistor A resistor is a passive two-terminal electrical component that implements electrical resistance as a circuit element. Resistors act to reduce current flow, and, at the same time, act to lower voltage levels within circuits. - Wikipedia; PROD_ID: RES-12581
R2 R5-R7 = SparkFun-Resistors:1KOHM: 1kΩ resistor A resistor is a passive two-terminal electrical component that implements electrical resistance as a circuit element. Resistors act to reduce current flow, and, at the same time, act to lower voltage levels within circuits. - Wikipedia; PROD_ID: RES-07856
R3 R8 R15 R19 R20 R22 R23 R25 R26 R28 R29 R31 R32 R35-R37 = SparkFun-Resistors:RESISTOR: Generic Resistor Package
R4 = SparkFun-Resistors:2.0KOHM: 2kΩ resistor A resistor is a passive two-terminal electrical component that implements electrical resistance as a circuit element. Resistors act to reduce current flow, and, at the same time, act to lower voltage levels within circuits. - Wikipedia; PROD_ID: RES-08296
R9-R11 = SparkFun-Resistors:10KOHM: 10kΩ resistor A resistor is a passive two-terminal electrical component that implements electrical resistance as a circuit element. Resistors act to reduce current flow, and, at the same time, act to lower voltage levels within circuits. - Wikipedia; PROD_ID: RES-00824
R12 = SparkFun-Resistors:100KOHM: 100kΩ resistor A resistor is a passive two-terminal electrical component that implements electrical resistance as a circuit element. Resistors act to reduce current flow, and, at the same time, act to lower voltage levels within circuits. - Wikipedia; PROD_ID: RES-07828
R13 R14 R18 = SparkFun-Resistors:4.7KOHM: 4.7kΩ resistor A resistor is a passive two-terminal electrical component that implements electrical resistance as a circuit element. Resistors act to reduce current flow, and, at the same time, act to lower voltage levels within circuits. - Wikipedia; PROD_ID: RES-07857
R16 R21 R24 R27 R30 R33 = SparkFun-Resistors:47KOHM: 47kΩ resistor A resistor is a passive two-terminal electrical component that implements electrical resistance as a circuit element. Resistors act to reduce current flow, and, at the same time, act to lower voltage levels within circuits. - Wikipedia; PROD_ID: RES-07871
R17 = SparkFun-Resistors:1MOHM: 1MΩ resistor A resistor is a passive two-terminal electrical component that implements electrical resistance as a circuit element. Resistors act to reduce current flow, and, at the same time, act to lower voltage levels within circuits. - Wikipedia; PROD_ID: RES-07868
R34 = chlimax:CB61F
R38 = SparkFun-Resistors:1MOHM: 1MΩ resistor A resistor is a passive two-terminal electrical component that implements electrical resistance as a circuit element. Resistors act to reduce current flow, and, at the same time, act to lower voltage levels within circuits. - Wikipedia; PROD_ID: RES-07868; VALUE: 1M
S1 = chlimax:EVQPUJ02K
TP1-TP39 = SparkFun-Connectors:TEST-POINT: SparkFun Test Points Bare copper test points for troubleshooting or In-Circuit-Testing. These are used by our Production team for verifying production board runs using pogo-pins on test beds. SparkFun Products: SparkFun LSM9DS1 Breakout <https://www.sparkfun.com/products/13284> SparkFun PSOC <https://www.sparkfun.com/products/13714> SparkFun Load Cell Amplifier <https://www.sparkfun.com/products/13879>
U1 = blimpy-2.0:PARTICLE_RGB-LED-CLMVB-FKA: CREE CLMVB-FKA RGB LED 2mm x 2mm
U2 = microbuilder:VREG_SOT23-5: SOT23-5 Fixed Voltage Regulators Part Current Out V Out V In V Dropout θJA (°C/W) TJ (°C) Digikey Part No. ADP121 150mA 3.3V 3.4-5.5V 0.09V @ 150mA -- -- ADP121-AUJZ33R7CT-ND ADP121 150mA 3.0V 3.1-5.5V 0.09V @ 150mA -- -- ADP121-AUJZ30R7CT-ND ADP122 300mA 3.3V 3.4-5.5V 0.085V @ 300mA -- -- ADP122AUJZ-3.3-R7CT-ND ADP1712 300mA 3.3V 3.5-5.5V 0.17V @ 300mA -- -- ADP1712AUJZ-3.3-R7TR-ND AP7311 (Low Cost) 150mA 3.3V 3.5-6V 0.15V @ 150mA -- -- AP7311-33WG-7DICT-ND LD39015M18R 150mA 1.8V 1.9V-5.5V 0.08V @ 100mA -- -- 497-6977-1-ND LP2985A-33DBVR 150mA 3.3V 3.3-16V 0.28V @ 150mA 206 150 296-18479-1-ND MCP1824T-3302E/OT 300mA 3.3V 3.5V-6V 0.2V @ 300mA -- -- MCP1824T-3302E/OTCT-ND MIC5205-2.5YM5 TR 150mA 2.5V 2.7-16V 0.165V @ 150mA -- -- 576-1257-2-ND MIC5205-3.0YM5 TR 150mA 3.0V 3.2V-16V 0.165V @ 150mA -- -- 576-1258-2-ND MIC5205-3.3YM5 TR 150mA 3.3V 3.5V-16V 0.165V @ 150mA -- -- 576-1259-2-ND TPS780330220 150mA 3.3V+2.2V 3.6-5.5V 250mV Max -- -- 296-23332-1-ND TDA3663/N1,135 100mA 3.3V 3.5-45V 0.18V @ 50mA -- -- 568-5343-1-ND Max operating temp can be calculated using θJA, TJ (max junction temperature), and power in watts. Set the "Maximum Ambient Temperature" until it reaches TJ ("Max Junction Temperature"), which is the absolute limit for safe use of the regulator: Heat Sink Temperature Calculator <http://www.daycounter.com/Calculators/Heat-Sink-Temperature-Calculator.phtml> For example, With 12V source into a 3.3V LP2985 and a 30mA load, we are dissipating (12V-3.3V) * 0.03A = 0.261W. With a θJA of 206 °C/W, a TJ of 150°C, and 261mW we can safely use the chip without a heat sink up to 75°C (=147.1°C Junction Temperature).
U3 = blimpy-2.0:MICROBUILDER_MCP73831/2: MCP73831/2 LIPO Charger VDD: 3.75 - 6V Temp -40 - 85°C Programmable Charge Rate: 15-500mA NOTE: STAT is a tri-state logic output on the MCP73831 and an open-drain output on the MCP73832. SOT23-5 with 4.2V output and tri-state logic on STAT = MCP73831T-2ACI/OT
U4 = chlimax:MAX17201G+; BUILT_BY: UL_Team_Molly; COPYRIGHT: Copyright (C) 2018 Accelerated Designs. All rights reserved; MANUFACTURER_PART_NUMBER: MAX17201G+; SOURCELIBRARY: Maxim_2018-10-24; VENDOR: Maxim Integrated Products
U5 = SparkFun-IC-Special-Function:SX1509: Semtech SX1509 The SX1509 is a complete ultra low voltage 1.2V to 3.6V General Purpose parallel Input/Output (GPIO) expanders ideal for low power handheld battery powered equipment. This version comes in a 16-channel configuration and allows easy serial expansion of I/O through a standard 400kHz I2C interface. GPIO devices can provide additional control and monitoring when the microcontroller or chipset has insufficient I/O ports, or in systems where serial communication and control from a remote location is advantageous. Datasheet <http://cdn.sparkfun.com/datasheets/BreakoutBoards/sx1509.pdf> SparkFun Products SparkFun 16 Output I/O Expander Breakout - SX1509 <https://www.sparkfun.com/products/13601> (BOB-13601) SparkFun Line Follower Array <https://www.sparkfun.com/products/13582> (SEN-13582); PROD_ID: IC-11311
U7 = microbuilder:CP2104: CP2104 - USB to UART Bridge VDD Output: 3.45V
U9 = ESP32:ESP-WROOM-32

## Board
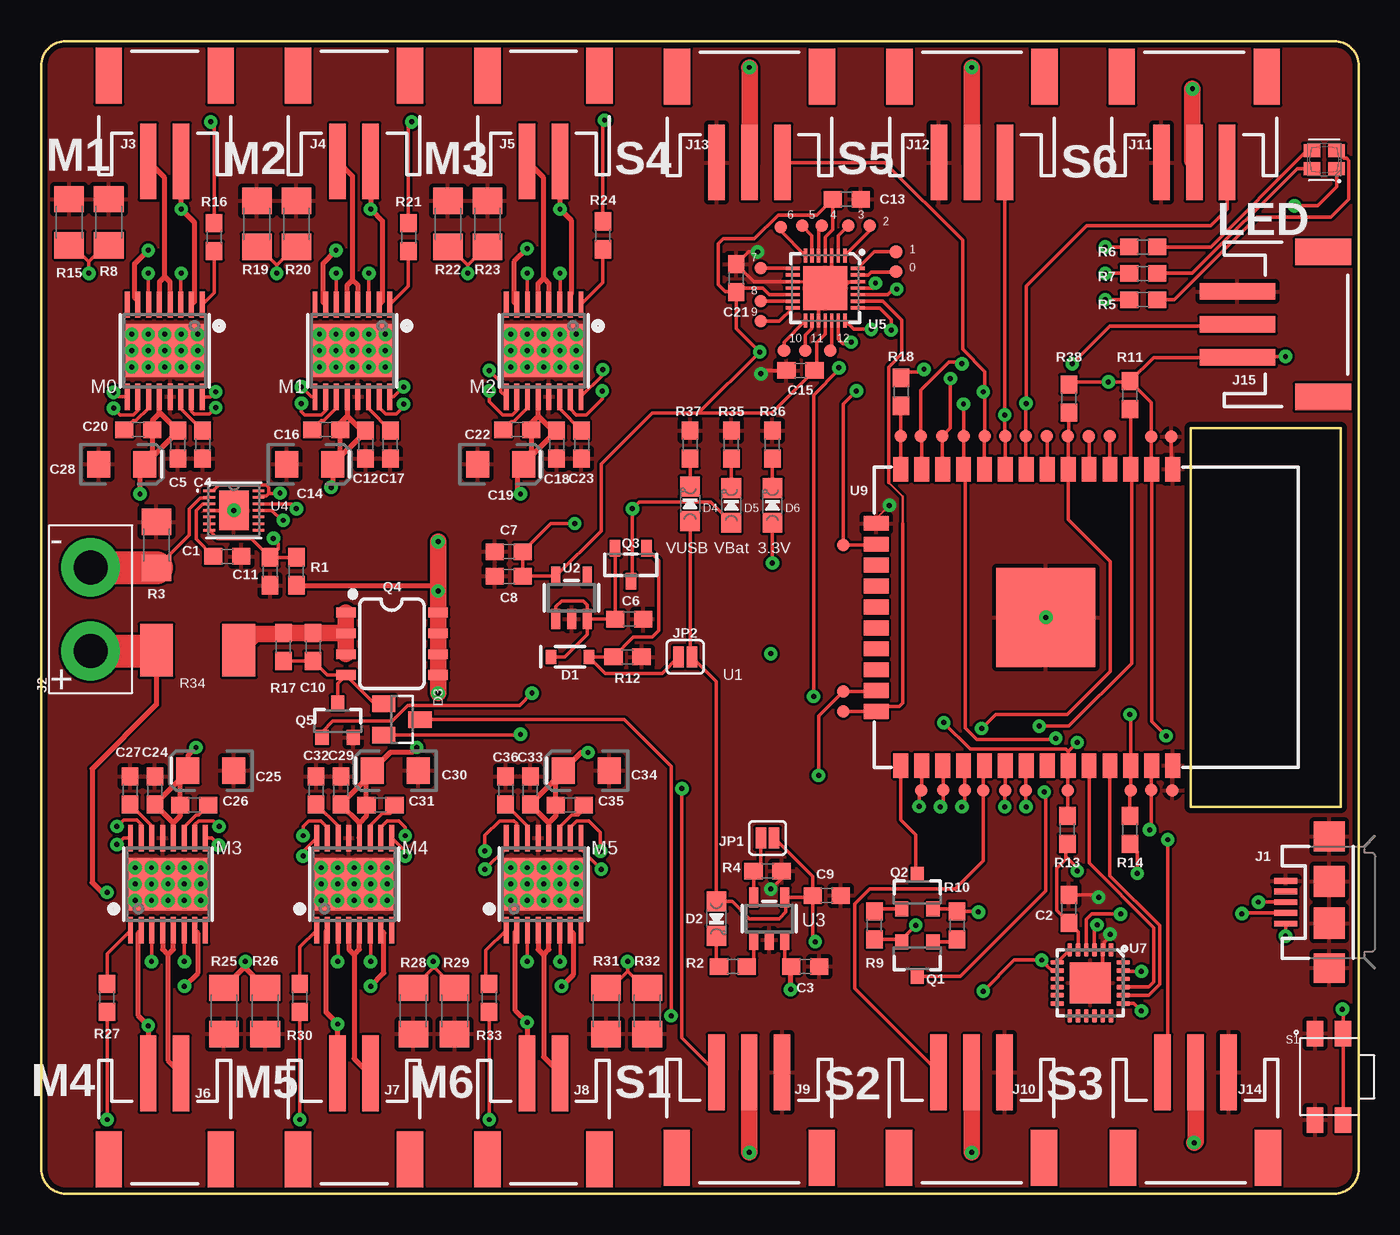
[diagram p2: board, top side]
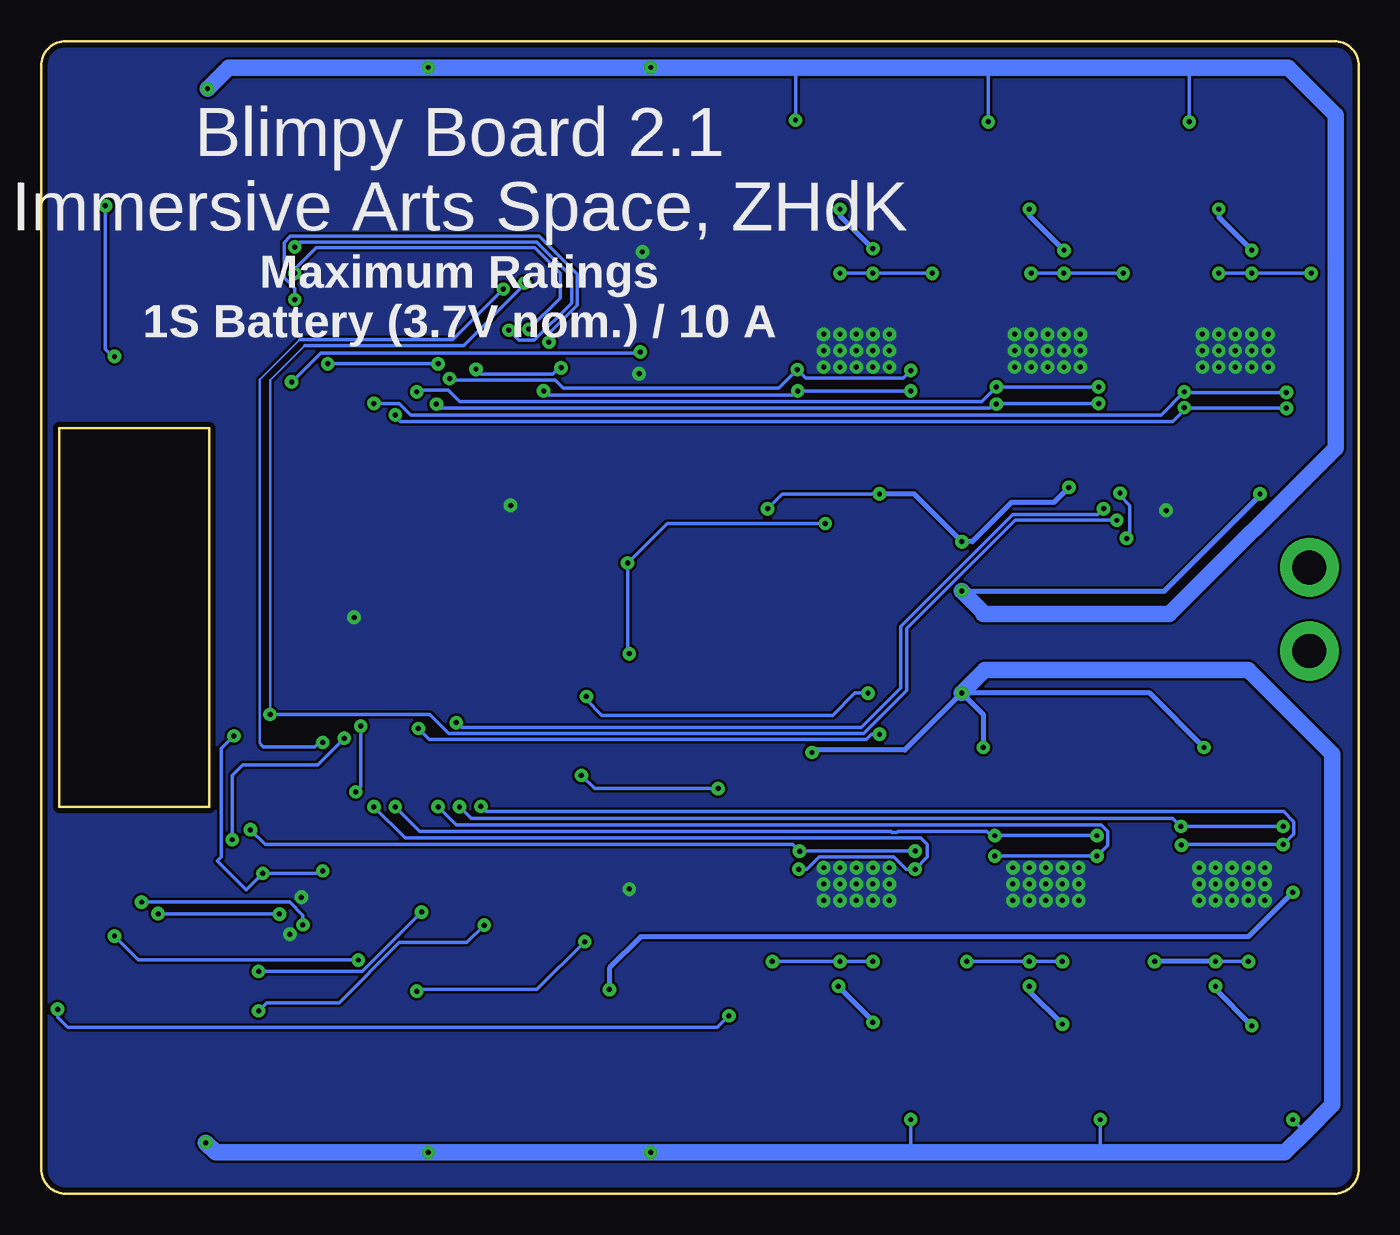
[diagram p3: board, bottom side, seen from below]

Size 80 x 70 mm. Coordinates in mm from the lower left corner, seen from the top.
Outline: 78.5,0 arc90 80,1.5 80,68.5 arc90 78.5,70 1.5,70 arc90 0,68.5 0,1.5 arc90 1.5,0 78.5,0
Outline: 69.8,46.5 78.9,46.5 78.9,23.5 69.8,23.5 69.8,46.5
Copper layers (1*16): Top 0.035mm / dielectric 1mm / Bottom 0.035mm
Design rules "SparkFun-2-layer-STANDARD *": minimum track width 6mil, minimum drill 0.3mm, track to track 6mil, track to pad 6mil, pad to pad 6mil, via to via 6mil, smd to smd 6mil, copper to edge 12mil, drill to drill 12mil, minimum pad ring 10mil, minimum via ring 10mil, stop-mask expansion 4mil, vias tented up to drill 25mil, thermal gap 10mil

### Footprints (pad centres in the part's own frame; a part is rotated, then mirrored left to right if it is on the bottom)
0603 = smd 1.1 x 1: 1 -0.85,0; 2 0.85,0
EIA3216 = smd 1.4 x 1.6: + 1.4,0; - -1.4,0
SOD-323 = smd 0.63 x 0.83: A 1.15,0; C -1.15,0
CHIPLED_0805_NOOUTLINE = smd 1.2 x 1.2: A 0,-1.05; C 0,1.05
SOT23 = smd 1 x 1.4: 1 -0.95,-1.1; 2 0.95,-1.1; 3 0,1.1
USB-MICROB = smd 1.4 x 0.35: D+ -2.65,0; D- -2.65,-0.65; GND -2.65,1.3; ID -2.65,0.65; VBUS -2.65,-1.3 | smd 1.9 x 1.8: MT1 0,-4; MT2 0,4 | smd 1.9 x 1.9: P$1 0,-1.27; P$2 0,1.27
1X02_XTRA_BIG = drill 2.057 pad 3.556: 1 -2.54,0; 2 2.54,0
JST-2-SMD = smd 1 x 4.6: 1 -1,-3.7; 2 1,-3.7 | smd 1.6 x 3.4: NC1 -3.4,1.5; NC2 3.4,1.5
JST-3-SMD = smd 1 x 4.6: 1 -1.99,-4.77; 2 0.01,-4.77; 3 2.01,-4.77 | smd 1.6 x 3.4: NC1 -4.39,0.43; NC2 4.41,0.43
SMT-JUMPER_2_NO_SILK = smd 0.635 x 1.27: 1 -0.406,0; 2 0.406,0
HTSSOP16 = smd 0.3 x 1.6: 1 -2.275,-2.8; 2 -1.625,-2.8; 3 -0.975,-2.8; 4 -0.325,-2.8; 5 0.325,-2.8; 6 0.975,-2.8; 7 1.625,-2.8; 8 2.275,-2.8; 9 2.275,2.8; 10 1.625,2.8; 11 0.975,2.8; 12 0.325,2.8; 13 -0.325,2.8; 14 -0.975,2.8; 15 -1.625,2.8; 16 -2.275,2.8 | smd 4.8 x 3.2: PPAD 0,0
SOT23-3 = smd 0.8 x 0.9: 1 -0.95,-1; 2 0.95,-1; 3 0,1.1
SOT23-R = smd 0.635 x 1.016: 1 -0.95,-1; 2 0.95,-1; 3 0,1
SO08 = smd 0.6 x 1.2: 1 -1.905,-2.8; 2 -0.635,-2.8; 3 0.635,-2.8; 4 1.905,-2.8; 5 1.905,2.8; 6 0.635,2.8; 7 -0.635,2.8; 8 -1.905,2.8
1206 = smd 1.6 x 1.8: 1 -1.4,0; 2 1.4,0
CB61F = smd 2 x 3.18: 1 -2.5,0; 2 2.5,0
EVQPUJ02K = smd 1.55 x 1: 1 2.625,0.85; 2 2.625,-0.85; 3 -2.625,0.85; 4 -2.625,-0.85
PAD.03X.03 = smd 0.762 x 0.762: P$1 0,0
PARTICLE_PLCC4-2MM-RGB = smd 1 x 0.8: BLUE -0.75,-0.55; CA 0.75,-0.55; GREEN -0.75,0.55; RED 0.75,0.55
SOT23-5 = smd 0.55 x 1.2: 1 -0.95,-1.3; 2 0,-1.3; 3 0.95,-1.3; 4 0.95,1.3; 5 -0.95,1.3
MICROBUILDER_SOT23-5 = smd 0.55 x 1.2: 1 -0.95,-1.3; 2 0,-1.3; 3 0.95,-1.3; 4 0.95,1.3; 5 -0.95,1.3
21-0137I_T1433-1_MXM = smd 0.711 x 0.152: 1 -1.499,1.2; 2 -1.499,0.8; 3 -1.499,0.4; 4 -1.499,0; 5 -1.499,-0.4; 6 -1.499,-0.8; 7 -1.499,-1.2; 8 1.499,-1.2; 9 1.499,-0.8; 10 1.499,-0.4; 11 1.499,0; 12 1.499,0.4; 13 1.499,0.8; 14 1.499,1.2 | smd 1.803 x 2.388: 15 0,0
QFN-28 = smd 0.85 x 0.2: 1 -1.975,1.2; 2 -1.975,0.8; 3 -1.975,0.4; 4 -1.975,0; 5 -1.975,-0.4; 6 -1.975,-0.8; 7 -1.975,-1.2; 15 1.975,-1.2; 16 1.975,-0.8; 17 1.975,-0.4; 18 1.975,0; 19 1.975,0.4; 20 1.975,0.8; 21 1.975,1.2 | smd 0.2 x 0.85: 8 -1.2,-1.975; 9 -0.8,-1.975; 10 -0.4,-1.975; 11 0,-1.975; 12 0.4,-1.975; 13 0.8,-1.975; 14 1.2,-1.975; 22 1.2,1.975; 23 0.8,1.975; 24 0.4,1.975; 25 0,1.975; 26 -0.4,1.975; 27 -0.8,1.975; 28 -1.2,1.975 | smd 2.65 x 2.65: 29 0,0
QFN24_4MM_SMSC = smd 0.8 x 0.28: 1 -2,1.25; 2 -2,0.75; 3 -2,0.25; 4 -2,-0.25; 5 -2,-0.75; 6 -2,-1.25; 13 2,-1.25; 14 2,-0.75; 15 2,-0.25; 16 2,0.25; 17 2,0.75; 18 2,1.25 | smd 0.28 x 0.8: 7 -1.25,-2; 8 -0.75,-2; 9 -0.25,-2; 10 0.25,-2; 11 0.75,-2; 12 1.25,-2; 19 1.25,2; 20 0.75,2; 21 0.25,2; 22 -0.25,2; 23 -0.75,2; 24 -1.25,2 | smd 2.5 x 2.5: THERM 0,0
ESP-WROOM-32 = smd 0.9 x 1.5: 1 7.7,9; 2 6.43,9; 3 5.16,9; 4 3.89,9; 5 2.62,9; 6 1.35,9; 7 0.08,9; 8 -1.19,9; 9 -2.46,9; 10 -3.73,9; 11 -5,9; 12 -6.27,9; 13 -7.54,9; 14 -8.81,9; 25 -8.81,-9; 26 -7.54,-9; 27 -6.27,-9; 28 -5,-9; 29 -3.73,-9; 30 -2.46,-9; 31 -1.19,-9; 32 0.08,-9; 33 1.35,-9; 34 2.62,-9; 35 3.89,-9; 36 5.16,-9; 37 6.43,-9; 38 7.7,-9 | smd 1.5 x 0.9: 15 -10.3,5.715; 16 -10.3,4.445; 17 -10.3,3.175; 18 -10.3,1.905; 19 -10.3,0.635; 20 -10.3,-0.635; 21 -10.3,-1.905; 22 -10.3,-3.175; 23 -10.3,-4.445; 24 -10.3,-5.715 | smd 6 x 6: GND 0,0

### Placement (x,y rotation side)
C1  11.3,38.7 0 top
C2  62.4,17.3 90 top
C3  46.4,13.8 0 top
C4  9.8,45.5 270 top
C5  8.3,45.5 270 top
C6  35.7,34.9 0 top
C7  28.4,39 180 top
C8  28.4,37.5 180 top
C9  47.7,18.1 0 top
C10  16.5,33.2 270 top
C11  13.9,37.8 270 top
C12  19.7,45.5 270 top
C13  48.9,60.4 0 top
C14  16.3,44.3 0 top
C15  46.1,50 180 top
C16  17.3,46.4 180 top
C17  21.2,45.5 270 top
C18  31.3,45.5 270 top
C19  27.9,44.3 0 top
C20  5.9,46.4 180 top
C21  42.2,55.6 90 top
C22  28.9,46.4 180 top
C23  32.8,45.5 270 top
C24  6.9,24.5 90 top
C25  10.3,25.7 180 top
C26  9.3,23.6 0 top
C27  5.4,24.5 90 top
C28  4.9,44.3 0 top
C29  18.2,24.5 90 top
C30  21.5,25.7 180 top
C31  20.6,23.6 0 top
C32  16.7,24.5 90 top
C33  29.7,24.5 90 top
C34  33.1,25.7 180 top
C35  32.1,23.6 0 top
C36  28.2,24.5 90 top
D1  32.1,32.6 0 top
D2  41,16.7 180 top
D3  21.9,28.8 270 top
D4  39.4,41.9 0 top
D5  41.9,41.8 0 top
D6  44.4,41.8 0 top
J1  78.2,17.7 0 top
J2  3,35.5 90 top
J3  7.5,66.4 0 top
J4  19,66.4 0 top
J5  30.5,66.4 0 top
J6  7.5,3.6 180 top
J7  19,3.6 180 top
J8  30.5,3.6 180 top
J9  43,2.6 180 top
J10  56.5,2.6 180 top
J11  70,67.4 0 top
J12  56.5,67.4 0 top
J13  43,67.4 0 top
J14  70.1,2.6 180 top
J15  77.4,52.8 270 top
JP1  44.1,21.6 0 top
JP2  39.1,32.6 0 top
M0  7.5,51.2 180 top
M1  18.9,51.2 180 top
M2  30.5,51.2 180 top
M3  7.7,18.8 0 top
M4  19,18.8 0 top
M5  30.5,18.8 0 top
Q1  53.2,14.3 180 top
Q2  53.2,18.3 0 top
Q3  35.8,38.2 180 top
Q4  21.3,33.4 270 top
Q5  18,28.7 0 top
R1  15.5,37.8 90 top
R2  42,13.8 0 top
R3  7,39.4 270 top
R4  44.1,19.6 180 top
R5  66.9,54.3 180 top
R6  66.9,57.5 180 top
R7  66.9,55.9 180 top
R8  4.1,59 270 top
R9  50.6,16.3 90 top
R10  55.6,16.3 270 top
R11  66.1,48.5 90 top
R12  35.6,32.6 180 top
R13  62.3,22.1 270 top
R14  66.1,22.1 90 top
R15  1.7,59 270 top
R16  10.5,58.1 270 top
R17  14.7,33.2 90 top
R18  52.2,48.7 270 top
R19  13.1,58.9 270 top
R20  15.5,58.9 270 top
R21  22.3,58.1 270 top
R22  24.7,58.9 270 top
R23  27.1,58.9 270 top
R24  34.1,58.2 270 top
R25  11.1,11.1 90 top
R26  13.6,11.1 90 top
R27  4,11.9 90 top
R28  22.6,11.1 90 top
R29  25.1,11.1 90 top
R30  15.7,11.9 90 top
R31  34.3,11.1 90 top
R32  36.8,11.1 90 top
R33  27.2,11.9 90 top
R34  9.5,33 0 top
R35  41.9,45.5 90 top
R36  44.4,45.5 90 top
R37  39.4,45.5 90 top
R38  62.4,48.3 90 top
S1  78.2,7.1 90 top
TP1  59.78,46 0 top
TP2  58.54,46.01 0 top
TP3  57.3,46 0 top
TP4  52.2,46 0 top
TP5  53.4,46 0 top
TP6  56,46 0 top
TP7  61.06,46.01 0 top
TP8  62.34,46.01 0 top
TP9  63.6,46 0 top
TP10  64.87,46 0 top
TP11  67.4,45.99 0 top
TP12  68.62,45.99 0 top
TP13  68.68,24.49 0 top
TP14  67.4,24.51 0 top
TP15  54.78,24.51 0 top
TP16  53.43,24.48 0 top
TP17  54.7,46 0 top
TP18  66.16,24.5 0 top
TP19  62.33,24.5 0 top
TP20  59.79,24.5 0 top
TP21  58.53,24.5 0 top
TP22  56.08,24.51 0 top
TP23  48.7,39.4 0 top
TP24  48.7,30.5 0 top
TP25  57.2,24.5 0 top
TP26  48.7,29.3 0 top
TP27  51.9,56 0 top
TP28  51.9,57.2 0 top
TP29  50.3,58.8 0 top
TP30  49,58.8 90 top
TP31  47.4,58.8 0 top
TP32  46.2,58.8 0 top
TP33  44.9,58.7 0 top
TP34  43.7,56.2 0 top
TP35  43.7,54.2 0 top
TP36  43.7,53 0 top
TP37  45.1,51.2 0 top
TP38  46.4,51.2 0 top
TP39  47.9,51.2 0 top
U1  77.9,62.8 0 top
U2  32.2,36.2 0 top
U3  44.2,16.7 0 top
U4  11.7,41.5 0 top
U5  47.6,55 270 top
U7  63.7,12.8 270 top
U9  61,35 0 top

### Tracks (layer width: path | path; a pad name or v marks a point on that pad's centre or on a via)
3.3V  (via drill 0.3)
  Top 0.2: R11.2 67.4,48.05 TP11.P$1 67.4,44.03 U9.2 67.43,28.67 v68.3,27.8 | U2.5 C8.1 C7.1 30.95,40.7 v32.4,40.7 | U2.5 | R14.1 66.1,21.2 66.55,20.75 v66.55,19.45 | U7.7 U7.6 U7.5 62.95,15.9 C2.1 61.65,17.2 61.65,19.75 62.2,20.3 | R11.2 66.1,49.5 65.9,49.3 v64.8,49.3 62.55,49.3 R38.2 | U2.5 34,40.25 34,44.3 37.1,47.4 39.9,47.4 | 62.2,20.3 62.3,20.4 62.9,19.8 v62.9,19.6 | 62.2,20.3 62.2,21.15 R13.2 | R11.2 67.54,50.79 J15.3 72.69,50.85 v75.55,50.85 | U5.4 47.6,58.1 48.05,58.55 C13.1 47.08,59.43 44.74,59.43 43.3,58 41.4,58 41.1,57.7 41.1,55.2 41.52,54.77 42.23,54.77 | U5.12 44.2,54.6 43.8,55 42.45,55 42.23,54.77 | 42.23,54.77 C21.1 42.2,52.55 v43.62,51.12 39.9,47.4 | U5.18 47.6,52.2 47.1,51.7 47.1,50.15 C15.1 44.35,47.4 39.9,47.4 | D6.A v44.4,38.3 | U1.CA 78.65,61.15 77.5,60 v76.1,60
  Bottom 0.2: v64.8,49.3 63.04,51.06 43.69,51.06 v43.62,51.12 | v62.9,19.6 63.05,19.45 v66.55,19.45 67.55,18.45 69.3,20.2 69.06,20.44 69.06,27.04 v68.3,27.8 | v44.3,32.8 44.4,32.9 v44.4,38.3 42,40.7 v32.4,40.7 | v76.1,60 76.1,51.3 75.6,50.8 v75.55,50.85
BAT+  (via drill 0.3)
  Top 0.2: C3.1 45.15,14.2 U3.3
  Top 0.3: R34.1 7,29.7 3.1,25.8 3.1,18.9 3.7,18.3 v4,18.3 | v45.5,12.4 45.5,13.75 C3.1
  Top 1.016: 6.96,32.96 R34.1
  Top 2: J2.1 6.96,32.96
  Bottom 0.3: v4,18.3 6.7,15.6 43.6,15.6 45.5,13.7 v45.5,12.4
BAT-
  Top 0.2: R3.2 9,40 9,41.59 9.67,42.25 10.15,42.25 U4.2
  Top 2: R3.2 3.04,38 J2.2
BLUE  (via drill 0.3)
  Top 0.2: R7.2 v64.6,55.9 | v50.4,52.5 49.33,52.5 U5.21
  Bottom 0.2: v50.4,52.5 48.5,54.4 48.5,55.9 50.05,57.45 63.3,57.45 64.6,56.15 v64.6,55.9
BOOT-SEL
  Top 0.2: U9.25 52.19,22.71 53.1,21.8 53.1,19.5 Q2.3
BTN  (via drill 0.3)
  Top 0.2: v29.1,27.9 29.05,27.85 D3.2 | v57.1,28.26 57.94,29.1 62.3,29.1 64.9,31.7 64.9,38.4 62.35,40.95 U9.6 62.35,46 | 62.35,46 TP8.P$1 | R38.1 62.4,46.05 62.35,46
  Bottom 0.2: v29.1,27.9 29.6,27.9 29.9,27.6 56.44,27.6 v57.1,28.26
CHIP-EN  (via drill 0.3)
  Top 0.2: v60.9,24.4 61,24.3 61,18.4 55.8,13.2 Q1.3 | v60.6,28.4 62.4,28.4 66.2,32.2 66.2,43.96 U9.3 66.16,47.59 R11.1
  Bottom 0.2: v60.9,24.4 60.6,24.7 v60.6,28.4
DTR  (via drill 0.3)
  Top 0.2: R10.1 55.7,17.15 | 55.7,17.15 56.85,17.15 v56.9,17.1 | v66.8,13.5 65.75,13.5 U7.23 | Q2.2 55.55,17.3 55.7,17.15
  Bottom 0.2: v56.9,17.1 60.5,13.5 v66.8,13.5
GND  (via drill 0.3)
  Top 0.152: U9.15 50.7,41 v51.5,41.8 | 48,55.4 48.1,55.4 | U5.29 47.5,55 47.1,55.4 U5.10
  Top 0.2: TP12.P$1 68.62,44.08 U9.1 | C2.2 64.05,18.15 v64.2,18 | R4.1 44.95,19.15 v44.3,18.5 | U4.15 U4.4 | v64.9,15.76 64.9,15.61 64.56,15.26 64.56,14.91 U7.2 64.45,13.55 U7.THERM | C15.2 43.9,50 v43.7,49.8 | v43.5,57.2 42.95,57.2 C21.2 43.25,55.4 U5.10 | 48,55.4 U5.29 | U5.17 47.2,54.6 U5.29 | U5.3 48,55.5 48.1,55.4 | U5.26 49.53,55.35 49.05,55.35 48.69,55 U5.29
  other vias: 7.5,51.2 5.7,19.8 6.7,19.8 7.7,19.8 8.7,19.8 9.7,19.8 9.7,18.8 9.7,17.8 8.7,17.8 7.7,17.8 8.7,18.8 6.7,18.8 6.7,17.8 5.7,18.8 5.7,17.8 17,19.8 18,19.8 19,19.8 20,19.8 21,19.8 17,18.8 18,18.8 20,18.8 21,18.8 17,17.8 18,17.8 19,17.8 20,17.8 21,17.8 5.5,52.2 6.5,52.2 7.5,52.2 8.5,52.2 9.5,52.2 5.5,51.2 6.5,51.2 8.5,51.2 9.5,51.2 16.9,52.2 17.9,52.2 18.9,52.2 19.9,52.2 20.9,52.2 16.9,51.2 17.9,51.2 19.9,51.2 20.9,51.2 5.5,50.2 6.5,50.2 7.5,50.2 8.5,50.2 9.5,50.2 16.9,50.2 17.9,50.2 18.9,50.2 19.9,50.2 20.9,50.2 28.5,19.8 29.5,19.8 30.5,19.8 31.5,19.8 32.5,19.8 28.5,18.8 29.5,18.8 31.5,18.8 32.5,18.8 28.5,17.8 29.5,17.8 30.5,17.8 31.5,17.8 32.5,17.8 28.5,52.2 29.5,52.2 30.5,52.2 31.5,52.2 32.5,52.2 32.5,51.2 32.5,50.2 31.5,50.2 30.5,50.2 31.5,51.2 29.5,51.2 29.5,50.2 28.5,51.2 28.5,50.2 11.7,41.5 61,35 7.7,18.8 19,18.8 30.5,18.8 30.5,51.2 18.9,51.2
  pour Top: -0.5,70.5 79.6,70.5 79.6,-0.5 -0.5,-0.5
  pour Bottom: -1,71 79.8,71 79.8,-1 -1,-1
GREEN  (via drill 0.3)
  Top 0.2: v64.6,57.5 R6.2 | U5.22 50.9,53.8 51.6,53.1 v51.6,52.44
  Bottom 0.2: v64.6,57.5 64.3,57.8 49.9,57.8 47.8,55.7 47.8,54.1 50.06,51.84 51,51.84 v51.6,52.44
IO0
  Top 0.2: U5.27 50.23,55.8 50.38,55.96 51.86,55.96 TP27.P$1
IO1
  Top 0.2: U5.28 50.58,57.2 TP28.P$1
IO1-RST
  Top 0.152: 52.3,40.7 52.3,42.35 51.45,43.2
  Top 0.2: TP26.P$1 50.69,29.3 U9.24 51.02,29.6 52.1,29.6 52.3,29.8 52.3,40.7 | U5.23 51.1,54.2 52.26,53.04 52.26,51.01 51.45,50.2 51.45,43.2
IO2
  Top 0.2: TP29.P$1 50.3,58.48 U5.1
IO3
  Top 0.2: U5.2 48.4,58.2 TP30.P$1
IO4
  Top 0.2: U5.5 47.2,58.6 TP31.P$1
IO5
  Top 0.2: U5.6 46.8,58.2 TP32.P$1
IO6
  Top 0.2: U5.7 44.9,58.48 TP33.P$1
IO7
  Top 0.2: TP34.P$1 U5.8
IO8
  Top 0.2: TP35.P$1 U5.13
IO9
  Top 0.2: TP36.P$1 44.83,53 U5.14
IO10
  Top 0.2: TP37.P$1 45.1,51.73 U5.15
IO11
  Top 0.2: TP38.P$1 46.4,52.14 46.8,52.54 U5.16
IO12
  Top 0.2: U5.19 48,51.3 TP39.P$1
LEDEXT  (via drill 0.3)
  Top 0.2: U9.13 53.46,45.94 TP5.P$1 53.4,48.8 55.1,50.5 55.81,50.5 v55.9,50.41 | v62.6,50.41 64.89,52.7 73.3,52.7 73.4,52.8 J15.2
  Bottom 0.2: v55.9,50.41 v62.6,50.41
N$1
  Top 0.2: R2.1 41,13.95 D2.C
N$2  (via drill 0.3)
  Top 0.2: v73.9,17.71 J1.D+ | U7.3 63.95,16.16 v64.11,16.32
  Bottom 0.2: v64.11,16.32 64.11,16.91 64.91,17.71 v73.9,17.71
N$3
  Top 0.2: U3.1 43.25,14.2 R2.2
N$4
  Top 0.2: JP1.1 43.69,20.04 R4.2 U3.5
N$5
  Top 0.2: M0.1 10.5,54.73 R16.2
N$6  (via drill 0.3)
  Top 0.2: J1.D- 72.95,17.05 v72.9,17 | U7.4 63.45,16.65 63.8,17 65.51,17 v65.53,16.98
  Bottom 0.2: v65.53,16.98 65.55,17 v72.9,17
N$7
  Top 0.2: C6.1 | C6.1 U2.3 | U2.3 33.15,35.75 32.9,36 31.6,36 31.25,35.65 U2.1 | C6.1 Q3.2 | D1.C 31.8,32.6 33.15,33.95 U2.3
N$8
  Top 0.2: C1.1 9.4,39.75 9.4,41.49 9.81,41.9 U4.3
N$9
  Top 0.2: U1.RED 79.1,62.9 79.25,62.9 79.4,62.76 79.4,60.4 78.3,59.3 73.8,59.3 68.8,54.3 R5.1
N$10
  Top 0.2: U1.BLUE 76.25,62.25 69.9,55.9 R7.1
N$11
  Top 0.2: R6.1 71,57.5 76.85,63.35 U1.GREEN
N$12
  Top 0.2: R10.2 55.58,15.43 55.45,15.3 Q1.1
N$13
  Top 0.2: R9.2 50.75,17.3 Q2.1
N$14  (via drill 0.3)
  Top 0.2: M0.3 8.47,55.88 v8.5,55.9 | v2.9,55.9 2.9,56.6 | 2.9,56.6 1.9,57.6 R15.2 | 2.9,56.6 3.9,57.6 R8.2 | M0.6 6.5,54.02 v6.5,55.9
  Bottom 0.2: v8.5,55.9 v6.5,55.9 v2.9,55.9
N$15  (via drill 0.3)
  Top 0.2: U4.5 U4.6 U4.7 10.7,39.8 12.75,39.8 C11.1 | 13.81,42.52 13.81,42.88 13.66,43.03 10.78,43.03 10.45,42.7 U4.1 | U4.13 13.27,42.37 13.66,42.37 13.81,42.52 | C11.1 14.4,39.15 14.4,39.5 v14.1,39.8 | R1.2 C11.1 | 13.81,42.52 14.46,42.52 v14.5,42.56
  Bottom 0.2: v14.5,42.56 14.5,42.4 13.9,41.8 13.9,40 v14.1,39.8
N$16
  Top 0.2: R17.1 C10.2 17.36,31.5 Q4.4 | Q4.4 18,31 Q5.3 | D3.1 20.25,29.75 Q4.4
N$17
  Top 0.2: D4.C R37.1
N$18
  Top 1.016: Q4.2 Q4.1 | Q4.3 Q4.2 | Q4.2 18.48,34.05 C10.1 R17.2 14.65,34 13,34 R34.2
N$19
  Top 0.2: U9.5 63.62,45.98 TP9.P$1
N$20
  Top 0.2: Q3.1 37.5,38.45 37.5,34.2 37.1,33.8 35.95,33.8 R12.2 D1.A 34.25,31.6 37.69,31.6 JP2.1
N$21
  Top 0.2: U9.7 61.08,45.99 TP7.P$1
N$22  (via drill 0.3)
  Top 0.2: v38.24,10.8 38.24,25.96 35.4,28.8 D3.3 | S1.4 S1.2 79.05,11.15 v79,11.2
  Bottom 0.2: v38.24,10.8 38.94,10.1 78.4,10.1 79,10.7 v79,11.2
N$23  (via drill 0.3)
  Top 0.2: v29.8,30.4 29.05,29.65 22.25,29.65 21.31,28.7 17.7,28.7 17.05,28.05 Q5.1 | R18.1 52.55,49.9 53.43,49.9 v53.6,50.07 | v46.9,30.2 46.9,48.5 48.44,50.04 v48.44,50.16
  Bottom 0.2: v29.8,30.4 30.6,30.4 31.95,29.05 45.95,29.05 46.9,30 v46.9,30.2 | v48.44,50.16 48.54,50.16 48.94,49.77 53.3,49.77 v53.6,50.07
N$24
  Top 0.3: M1.5 18.57,55.17 18.9,55.5 | 18.9,55.5 19.23,55.17 M1.4 | J4.1 18.9,61.8 18.9,55.5
N$25  (via drill 0.3)
  Top 0.3: M1.7 17.1,54.17 17.1,56.5 v17.9,57.3 | M1.2 20.72,54.2 20.72,59.08 v20,59.8 J4.2
  Bottom 0.3: v17.9,57.3 20,59.4 v20,59.8
N$26
  Top 0.2: C17.1 19.88,47.67 M1.14
N$27
  Top 0.2: C16.2 17,46.95 17.15,46.95 17.93,47.73 M1.11
N$28  (via drill 0.3)
  Top 0.2: M1.3 19.88,55.88 v19.9,55.9 | v14.3,55.9 14.3,56.4 | 14.3,56.4 13.2,57.5 R19.2 | 14.3,56.4 15.4,57.5 R20.2 | M1.6 17.93,55.88 v17.91,55.9
  Bottom 0.2: v19.9,55.9 v17.91,55.9 v14.3,55.9
N$29
  Top 0.2: R21.2 22.3,55.12 M1.1
N$30
  Top 0.3: M3.4 7.38,14.82 7.7,14.5 | 7.7,14.5 8.03,14.82 M3.5 | J6.1 7.7,8.1 7.7,14.5
N$31
  Top 0.3: M2.5 30.18,55.27 30.5,55.6 | 30.5,55.6 30.82,55.27 M2.4 | 30.5,55.6 30.5,61.7 J5.1
N$32
  Top 0.2: M2.14 31.48,47.67 C23.1
N$33
  Top 0.2: M2.11 29.52,47.73 28.7,46.9 28.55,46.9 C22.2
N$34  (via drill 0.3)
  Top 0.2: R22.2 24.7,57.6 25.9,56.4 | 25.9,56.4 27,57.5 R23.2 | M2.6 29.52,55.88 v29.51,55.9 | v31.5,55.9 31.5,54.02 M2.3 | v25.9,55.9 25.9,56.4
  Bottom 0.2: v31.5,55.9 30.4,55.9 v29.51,55.9 v25.9,55.9
N$35
  Top 0.2: M2.1 34.1,55.33 R24.2
N$36  (via drill 0.3)
  Top 0.3: v8.7,12.6 9.52,13.42 9.52,15.8 M3.7 | M3.2 5.9,15.82 5.9,10.8 v6.5,10.2 J6.2
  Bottom 0.3: v6.5,10.2 8.7,12.4 v8.7,12.6
N$37  (via drill 0.3)
  Top 0.3: M0.7 5.88,54.23 5.68,54.42 5.68,56.48 v6.5,57.3 | J3.2 v8.5,59.8 9.3,59 9.3,58.8 9.3,54.17 M0.2
  Bottom 0.3: v8.5,59.8 8.5,59.3 v6.5,57.3
N$38
  Top 0.3: M4.4 18.68,14.82 19,14.5 | 19,14.5 19.32,14.82 M4.5 | 19,14.5 19,8.2 19.9,7.3 J7.1
N$39
  Top 0.2: C27.1 6.72,22.32 M3.14
N$40
  Top 0.2: C26.2 9.55,23 9.41,23 8.68,22.27 M3.11
N$41  (via drill 0.3)
  Top 0.2: M3.3 6.72,14.12 v6.7,14.1 | v8.7,14.1 8.68,14.12 M3.6
  Top 0.3: R25.2 12.4,13.8 v12.4,14.1 12.4,13.7 R26.2
  Bottom 0.2: v6.7,14.1 v8.7,14.1
  Bottom 0.3: v8.7,14.1 v12.4,14.1
N$42
  Top 0.2: R27.2 4,14.57 M3.1
N$43  (via drill 0.3)
  Top 0.3: M5.7 32.3,15.82 32.3,13.3 v31.6,12.6 | J8.2 v29.5,10.4 28.79,11.11 28.79,15.92 M5.2
  Bottom 0.3: v31.6,12.6 29.5,10.5 v29.5,10.4
N$44  (via drill 0.3)
  Top 0.3: J7.2 v18,10.3 17.29,11.01 17.29,15.92 M4.2 | v20,12.6 20.8,13.4 20.8,15.82 M4.7
  Bottom 0.3: v18,10.3 20,12.3 v20,12.6
N$45
  Top 0.2: C32.1 18.02,22.32 M4.14
N$46
  Top 0.2: M4.11 19.98,22.38 20.7,23.1 21.2,23.1 21.45,23.35 C31.2
N$47  (via drill 0.3)
  Top 0.2: M4.3 18.02,14.12 v18,14.1 | v20,14.1 20,15.97 M4.6 | R28.2 23.8,13.7 v23.8,14.1 23.8,13.8 R29.2
  Bottom 0.2: v18,14.1 v20,14.1 v23.8,14.1
N$48  (via drill 0.3)
  Top 0.3: M2.2 32.12,54.6 32.21,54.68 32.21,59.09 v31.5,59.8 J5.2 | M2.7 28.7,54.17 28.7,56.6 v29.5,57.4
  Bottom 0.3: v31.5,59.8 31.5,59.4 v29.5,57.4
N$49
  Top 0.2: R30.2 15.7,14.97 M4.1
N$50
  Top 0.3: M5.4 30.18,14.82 30.5,14.5 | 30.5,14.5 30.82,14.82 M5.5 | J8.1 30.5,8.3 30.5,14.5
N$51
  Top 0.2: R36.1 D6.C
N$52
  Top 0.2: C36.1 29.52,22.32 M5.14
N$53
  Top 0.2: C35.2 32.95,23.36 32.6,23 32.2,23 31.48,22.27 M5.11
N$54  (via drill 0.3)
  Top 0.2: v35.6,14.1 35.6,13.5 | 35.6,13.5 34.6,12.5 R31.2 | 35.6,13.5 36.6,12.5 R32.2 | M5.3 29.52,14.12 v29.5,14.1 | M5.6 31.5,15.97 v31.5,14.1
  Bottom 0.2: v29.5,14.1 v31.5,14.1 v35.6,14.1
N$55
  Top 0.2: R33.2 27,12.95 27,14.78 M5.1
N$56
  Top 0.2: D5.C R35.1
N$57
  Top 0.2: TP10.P$1 64.89,45.98 U9.4
N$58
  Top 0.3: M0.4 7.83,55.38 7.5,55.7 | 7.5,55.7 7.17,55.38 M0.5 | J3.1 7.5,61.7 7.5,55.7
N$61
  Top 0.2: C4.1 8.47,47.67 M0.14
N$64
  Top 0.2: C20.2 5.6,46.95 5.75,46.95 6.53,47.73 M0.11
PWM0-1  (via drill 0.3)
  Top 0.2: U9.8 59.78,44.03 TP1.P$1 59.78,48.08 59.8,48.1 | v59.8,48 59.8,48.1 | J11.3 72.01,59.81 71,58.8 63.47,58.8 59.8,55.13 59.8,48.1 | M0.16 9.8,48.37 10.27,48.37 v10.6,48.7 | v4.4,48.66 4.66,48.4 M0.9
  Bottom 0.2: v59.8,48 58.27,48 57.57,47.3 12,47.3 v10.6,48.7 10.56,48.66 v4.4,48.66
PWM0-2  (via drill 0.3)
  Top 0.2: U9.9 TP2.P$1 58.5,46.04 v58.5,47.3 v58.51,47.31 J12.3 | v4.4,47.7 4.8,47.3 5.6,47.3 5.88,47.58 M0.10 | M0.15 9.12,47.52 9.3,47.35 10.21,47.35 v10.6,47.74
  Bottom 0.2: v58.5,47.3 58.5,47.2 58.2,46.9 11.3,46.9 10.6,47.6 v10.6,47.74 10.56,47.7 v4.4,47.7
PWM1-1  (via drill 0.3)
  Top 0.2: U9.10 57.27,45.97 TP3.P$1 57.3,48.6 | v22,49 21.4,48.4 M1.16 | v15.8,49 16.4,48.4 M1.9 | J13.3 51.22,62.63 55.95,57.9 55.95,51.28 57.3,49.94 57.3,48.6 | 57.3,48.6 v57.2,48.7
  Bottom 0.2: v57.2,48.7 57.1,48.8 55.3,48.8 54.6,48.1 22.9,48.1 v22,49 v15.8,49
PWM1-2  (via drill 0.3)
  Top 0.2: v56,47.96 TP6.P$1 U9.11 56.1,43.9 56.1,28.3 56.8,27.6 61.54,27.6 v61.6,27.66 | v15.8,48 15.8,47.5 16,47.3 17,47.3 17.27,47.58 M1.10 | v22,47.96 22,47.8 21.55,47.35 20.92,47.35 20.52,47.74 M1.15 | v68.4,21.5 68.4,7.68 J14.3
  Bottom 0.2: v56,47.96 55.74,47.7 22.4,47.7 22.1,48 22.04,48 v22,47.96 21.96,48 v15.8,48 | v68.4,21.5 68.4,25.4 67.75,26.05 63.21,26.05 v61.6,27.66
PWM2-1  (via drill 0.3)
  Top 0.2: U9.12 54.7,44.03 TP17.P$1 55.2,46.5 v55.2,49.5 | M2.9 27.9,48.73 27.9,49.3 v27.2,50 | v34.1,50.06 34.1,49.73 M2.16
  Bottom 0.2: v55.2,49.5 55.11,49.41 48.8,49.41 48.31,48.93 35.23,48.93 v34.1,50.06 33.59,49.54 27.66,49.54 v27.2,50
PWM2-2  (via drill 0.3)
  Top 0.2: U9.16 50.66,39.4 TP23.P$1 48.7,47.96 v49.5,48.76 | M2.15 32.12,47.67 32.5,47.3 33.1,47.3 34.06,48.26 v34.06,48.76 | M2.10 28.88,47.58 28.6,47.3 28.02,47.3 27.2,48.12 v27.2,48.76
  Bottom 0.2: v49.5,48.76 49.24,48.5 34.32,48.5 v34.06,48.76 v27.2,48.76
PWM3-1  (via drill 0.3)
  Top 0.2: v53.3,23.52 53.3,24.34 TP16.P$1 53.46,24.5 U9.26 | v4.6,21.2 5,21.6 M3.16 | M3.9 10.34,21.6 v10.77,21.17
  Bottom 0.2: v53.3,23.52 52.98,23.2 4.57,23.2 3.94,22.57 3.94,21.86 v4.6,21.2 10.74,21.2 v10.77,21.17
PWM3-2  (via drill 0.3)
  Top 0.2: v54.6,23.5 54.78,23.68 TP15.P$1 54.78,25.95 U9.27 | M3.10 9.32,22.43 9.55,22.65 10.45,22.65 v10.8,22.3 | M3.15 6.08,22.43 5.8,22.7 5,22.7 v4.6,22.3
  Bottom 0.2: v54.6,23.5 53.9,22.8 11.3,22.8 v10.8,22.3 v4.6,22.3
PWM4-1  (via drill 0.3)
  Top 0.2: v55.9,23.5 56.08,23.68 TP22.P$1 56.08,25.92 U9.28 | v15.9,20.5 15.9,20.77 M4.16 | M4.9 22.1,20.77 v22.1,20.5
  Bottom 0.2: v55.9,23.5 54.8,22.4 15.63,22.4 15.24,22.02 15.24,21.16 v15.9,20.5 v22.1,20.5
PWM4-2  (via drill 0.3)
  Top 0.2: v58.5,23.5 58.5,24.47 TP21.P$1 U9.30 | M4.15 17.38,22.26 16.98,22.65 16.25,22.65 15.9,22.3 v15.9,21.74 | v22.1,21.74 22.1,22.25 21.7,22.65 21.02,22.65 20.62,22.26 M4.10
  Bottom 0.2: v58.5,23.5 57,22 28.4,22 28.35,21.95 28.05,21.95 28,22 22.6,22 22.34,21.74 v22.1,21.74 v15.9,21.74
PWM5-1  (via drill 0.3)
  Top 0.2: U9.31 59.79,25.98 TP20.P$1 59.79,23.51 v59.8,23.5 | v26.94,19.7 28.23,20.98 M5.16 | v34,19.7 32.77,20.93 M5.9
  Bottom 0.2: v34,19.7 33.53,19.7 32.77,20.46 28.23,20.46 27.47,19.7 v26.94,19.7 26.2,20.44 26.2,21.2 26.6,21.6 27.9,21.6 27.91,21.59 28.49,21.59 28.5,21.6 57.9,21.6 v59.8,23.5
PWM5-2  (via drill 0.3)
  Top 0.2: v67.3,22.1 67.4,22.2 TP14.P$1 67.4,25.97 U9.37 | M5.10 32.12,22.26 32.52,22.65 33.25,22.65 33.96,21.94 v33.96,20.8 | M5.15 28.88,22.48 28.7,22.65 27.85,22.65 26.94,21.74 v26.94,20.81
  Bottom 0.2: v26.94,20.81 33.95,20.81 v33.96,20.8 34.36,21.2 66.4,21.2 v67.3,22.1
PWR
  Top 0.2: U9.14 TP4.P$1 R18.2
RED  (via drill 0.3)
  Top 0.2: U5.20 48.4,51.9 48.66,51.64 49.1,51.64 v49.18,51.72 | R5.2 v64.6,54.3
  Bottom 0.2: v49.18,51.72 49.18,52.23 47.45,53.95 47.45,55.85 49.76,58.16 64.87,58.16 65.26,57.77 65.26,55.63 64.6,54.97 v64.6,54.3
RTS  (via drill 0.3)
  Top 0.2: U7.19 66.35,11.55 v66.8,11.1 | v53.1,16.3 52.15,15.35 52.05,15.45 R9.1 52.1,15.45 Q1.2
  Bottom 0.2: v66.8,11.1 66.3,11.6 61.9,11.6 58.25,15.25 54.15,15.25 v53.1,16.3
RX
  Top 0.2: U7.21 67.25,12.55 67.55,12.85 67.55,16.15 63.62,20.08 U9.34
S1-SIG  (via drill 0.3)
  Top 0.2: U9.23 50.65,30.5 TP24.P$1 47.2,29 v47.2,25.4 | J9.3 38.9,9.46 v38.9,24.6
  Bottom 0.2: v38.9,24.6 46.4,24.6 v47.2,25.4
S2-SIG
  Top 0.2: U9.29 57.2,25.93 TP25.P$1 57.2,20.2 55.5,18.5 50.3,18.5 49.4,17.6 49.4,12.46 J10.3
SCL  (via drill 0.3)
  Top 0.2: R14.2 66.1,24.44 TP18.P$1 U9.36 66.16,29.04 v66.1,29.1 | U4.11 14,41.5 14.6,40.9 v14.7,40.9 | U5.25 50.66,55 v50.66,55.3
  Bottom 0.152: v66.1,29.1 66.1,49.41 64,51.51
  Bottom 0.2: 64,51.51 59.8,51.51 54.34,51.51 50.66,55.2 v50.66,55.3 | v66.1,29.1 65.7,29.1 65.69,29.11 56.4,29.11 55.24,27.95 30.05,27.95 27.45,30.55 27.45,34.32 20.86,40.9 v14.7,40.9
SDA  (via drill 0.3)
  Top 0.2: R13.1 62.33,22.98 TP19.P$1 62.33,25.98 U9.33 62.35,26.85 | 62.35,26.85 v62.9,27.4 | U4.12 15.2,41.9 v15.5,41.6 | 62.35,26.85 62.2,27 56.4,27 v54.8,28.6 v54.8,28.61 | U5.24 51.4,54.6 51.8,55 51.88,55 v51.94,54.94
  Bottom 0.152: 66.64,27.26 66.73,27.36 66.73,49.45 64.3,51.89
  Bottom 0.2: 64.3,51.89 55,51.89 v51.94,54.94 | 66.64,27.26 66.52,27.14 63.4,27.14 63.14,27.4 v62.9,27.4 | v15.5,41.6 15.85,41.25 21.01,41.25 27.8,34.46 27.8,30.7 30.2,28.3 54.47,28.3 54.77,28.61 v54.8,28.61
TX
  Top 0.2: U9.35 64.89,19.31 67.9,16.3 67.9,12.7 67.25,12.05 U7.20
V_BATT  (via drill 0.3)
  Top 0.152: 37.7,42 37.8,42
  Top 0.2: C30.+ 20,25.6 19.85,25.45 | C14.+ 18.15,44.75 | C12.1 19.45,46.35 | C20.1 6.75,46.95 | C28.+ 6.1,44.5 | 28.9,44.35 28.95,44.3 C19.+ 29.75,44.75 | C18.1 31.05,46.35 | 31.25,25.25 C34.+ | R30.1 v15.7,4.5 | R33.1 v27.2,4.5 | R27.1 v4,4.5 | R16.1 10.5,64.9 v10.3,65.1 | R21.1 22.3,64.9 v22.5,65.1 | R24.1 34.1,65.1 v34.2,65.2 | Q3.3 35.9,37.3 v35.9,41.6 36.3,42 37.7,42 | 37.8,42 38.89,42 38.9,42 40.65,42 D5.A
  Top 0.3: 18.15,44.75 C16.1 18.15,46.8 18.57,47.23 | C12.1 19.7,46.3 C14.+ 17.7,43 v17.6,42.9 | M1.12 18.57,47.23 | 19.45,46.35 18.57,47.23 | 7.17,47.48 7.17,47.38 6.75,46.95 | 7.17,47.48 M0.12 | 7.17,47.48 C5.1 8.3,46.3 6.75,44.75 | 30.18,47.23 M2.12 | C18.1 28.9,43.95 | 31.05,46.35 30.18,47.23 | 29.75,44.75 C22.1 29.75,46.8 30.18,47.23 | 31.25,25.25 C35.1 31.25,22.95 30.82,22.52 | 8.03,22.52 C24.1 8.9,25.65 C25.+ 8.9,25.9 | M3.12 8.03,22.52 | 28.9,44.35 28.9,43.95 | 28.9,43.95 28.9,42.7 v29.1,42.5 | v6,42.5 6,44.4 6.1,44.5 | R1.1 23.75,36.95 v24.1,36.6 | 8.9,25.9 8.9,26.6 v9.4,27.1 | v33.2,26.8 32.8,26.8 C34.+ 31.7,25.65 C33.1 30.82,22.52 | 6.75,44.75 C28.+ | 8.9,25.9 8.45,25.45 C26.1 8.45,22.95 8.03,22.52 | C20.1 6.75,44.75 | 20,25.6 20,25.45 C29.1 19.3,22.55 19.3,22.5 | 19.85,25.45 19.75,25.35 C31.1 19.75,22.95 19.3,22.5 | 19.3,22.5 19.3,21.62 M4.12 | v22.8,27.1 22.5,26.8 21.2,26.8 C30.+ | 30.82,22.52 M5.12
  Top 1: Q4.7 Q4.6 | Q4.5 v24.1,30.4 | v70,3.1 70.09,3.19 J14.2 | J10.2 v56.5,2.5 | J9.2 v42.99,2.51 v43,2.5 | v69.9,67.1 69.9,62.74 J11.2 | J12.2 v56.5,68.4 | J13.2 v43.01,68.39 v43,68.4 | v24.1,39.6 v24.1,36.6 Q4.8
  Top 1.016: Q4.8 Q4.7 | Q4.6 Q4.5
  Bottom 0.2: v15.7,4.5 15.7,2.8 16,2.5 | v27.2,4.5 27.2,2.7 27.4,2.5 | v4,4.5 3.3,3.8 3.2,3.8 | v10.3,65.1 10.3,68.4 | v22.5,65.1 22.5,68.4 | v34.2,65.2 34.2,68.4 | v29.1,42.5 35,42.5 v35.9,41.6
  Bottom 0.3: v6,42.5 6,42.4 11.8,36.6 v24.1,36.6 | v9.4,27.1 12.7,30.4 v24.1,30.4 | v24.1,30.4 27.56,26.94 33.06,26.94 v33.2,26.8 | v17.6,42.9 18.5,42 21.07,42 23.47,39.6 v24.1,39.6 27,42.5 v29.1,42.5 | v24.1,30.4 22.8,29.1 v22.8,27.1
  Bottom 1: v24.1,30.4 22.7,31.8 6.7,31.8 1.6,26.7 1.6,5.4 3.2,3.8 4.5,2.5 16,2.5 27.4,2.5 v43,2.5 v56.5,2.5 69.4,2.5 v70,3.1 | v24.1,36.6 22.8,35.3 22.8,35.2 11.5,35.2 1.4,45.3 1.4,65.5 4.3,68.4 10.3,68.4 22.5,68.4 34.2,68.4 v43,68.4 v56.5,68.4 68.6,68.4 v69.9,67.1
V_USB  (via drill 0.3)
  Top 0.2: C9.1 46.75,18 U3.4 45.2,17.95 45.2,17.1 44.8,16.7 43,16.7 41.95,17.75 D2.A 41,31.11 JP2.2 39.4,32.71 D4.A | U7.8 61.34,13.55 61.05,13.85 61.05,13.88 v60.74,14.19 59.09,14.19 v57.2,12.3 | C9.1 46.85,15.45 v47,15.3 | v75.55,15.64 J1.VBUS | C9.1 46.85,19.26 JP1.2
  Bottom 0.2: v47,15.3 49.9,12.4 57.2,12.4 v57.2,12.3 | v60.74,14.19 74.09,14.19 v75.55,15.64

### Text on the board
tNames: M1 | M2 | M3 | S4 | S5 | S6 | LED | 6 | 5 | 4 | 3 | 2 | 7 | 1 | 0 | 8 | 9 | 10 | 11 | 12 | VUSB | VBat | 3.3V | - | R34 | U1 | + | S1 | M4 | M5 | M6 | S1 | S2 | S3
bNames: Blimpy Board 2.1 / Immersive Arts Space, ZHdK | Maximum Ratings / 1S Battery (3.7V nom.) / 10 A